# Altium project SmartHaloEE.PrjPcb (part 1 of 2)
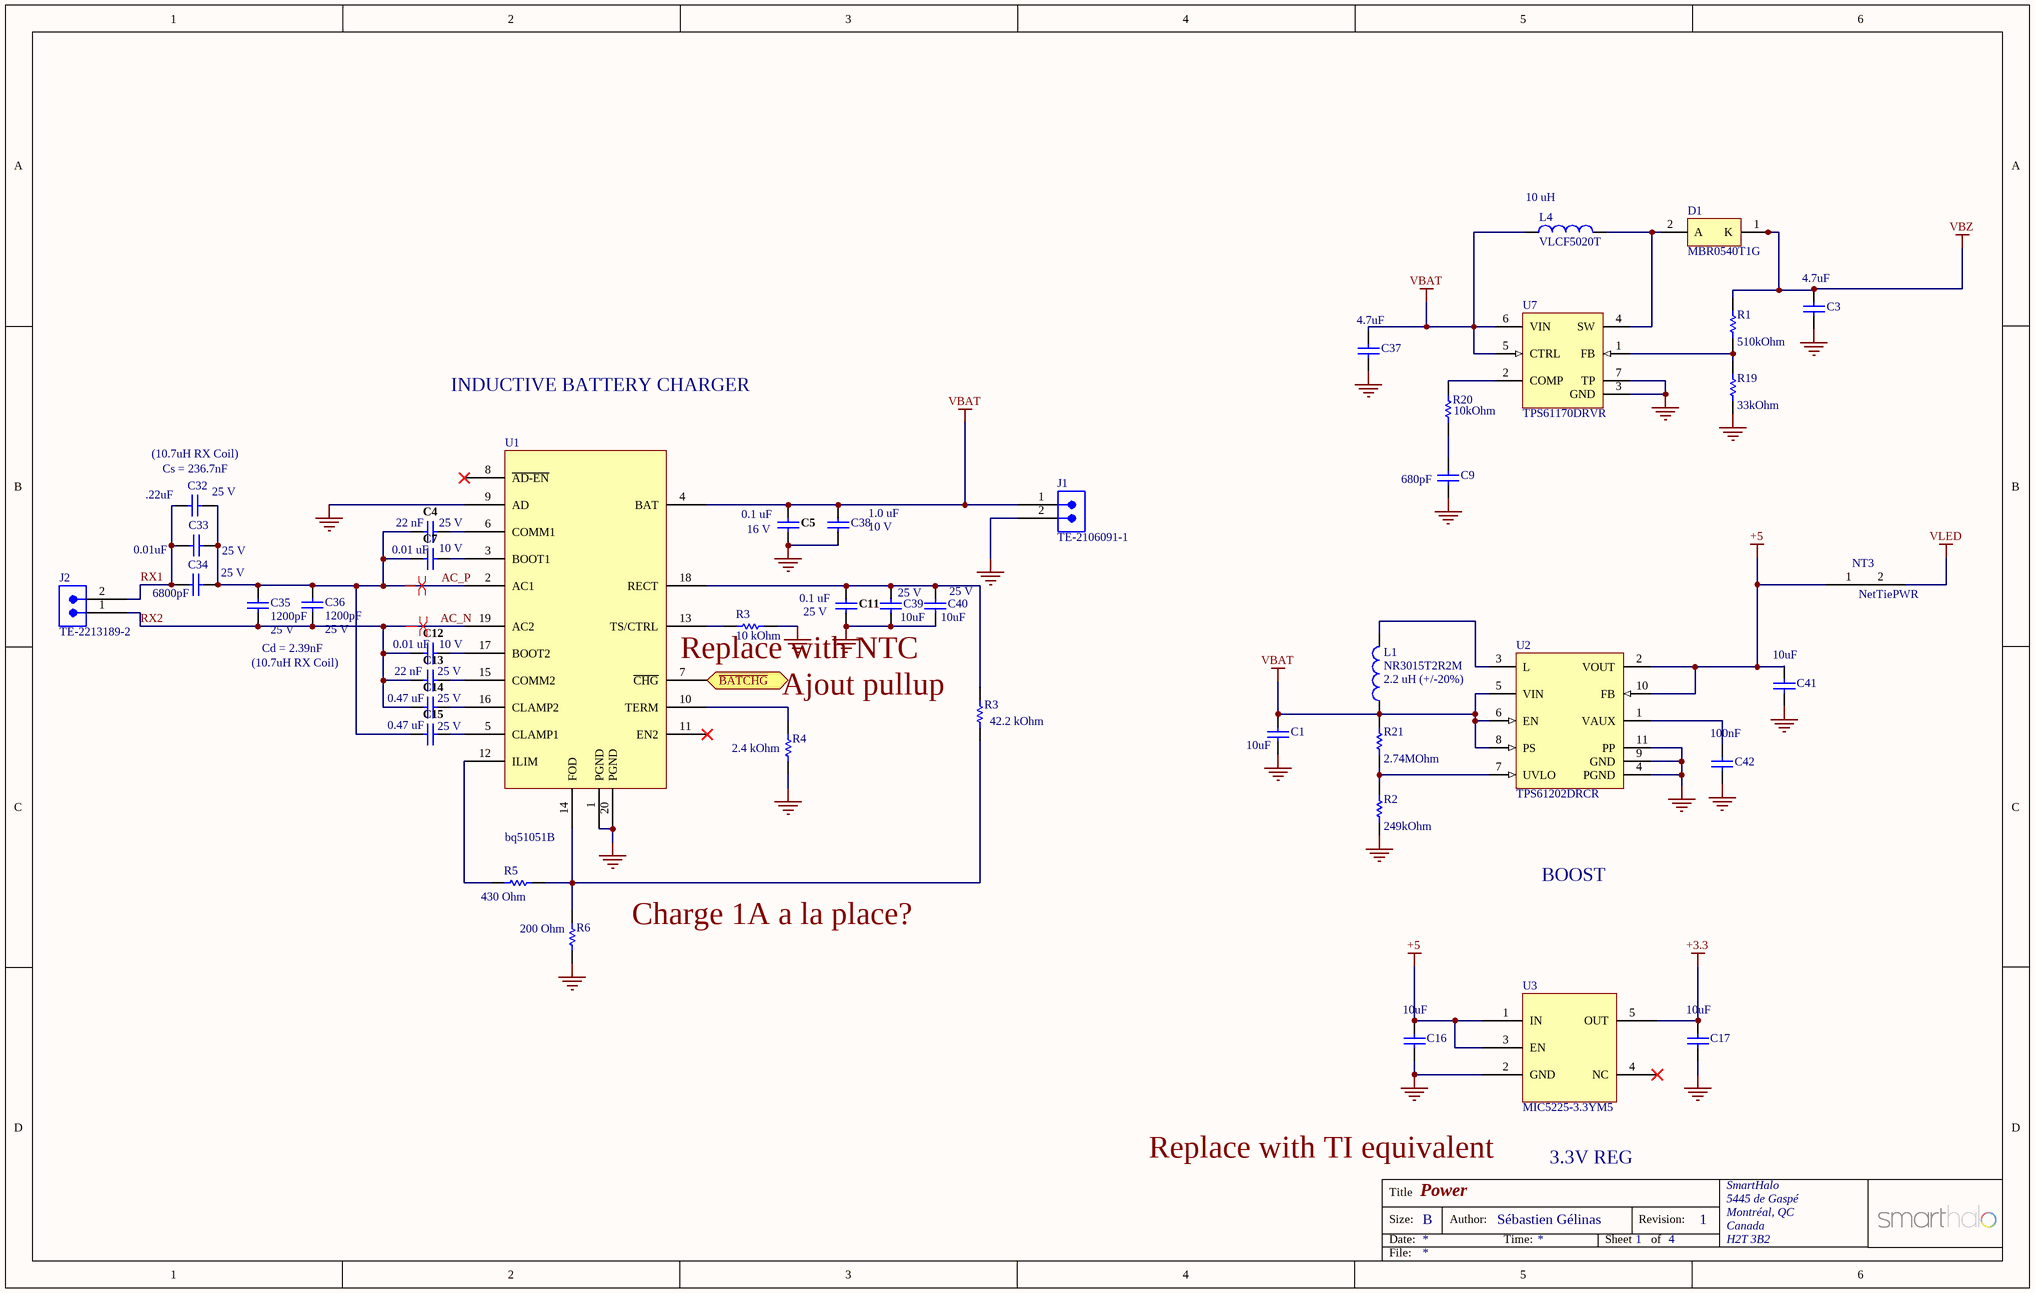
[diagram p0: PWR.SchDoc]
8 sheets, 165 parts. Net scope: flat (ports and power ports of the same name join across sheets).
Sheets:
  PWR.SchDoc
  SENSORS.SchDoc
  BLE.SchDoc
  ALARM.SchDoc
  CENTRALLEDS.SchDoc
  DRIVERS_CONNECTORS.SchDoc
  LEDS1.SchDoc
  LEDS2.SchDoc

## Sheet PWR.SchDoc: Power
size B; Author: Sébastien Gélinas; Organization: SmartHalo; Address1: 5445 de Gaspé; Address2: Montréal, QC; Address3: Canada; Address4: H2T 3B2; DocumentNumber: 1; Revision: 1; SheetNumber: 1; SheetTotal: 4

### Parts
(Parts that share a designator on the sheet are numbered #1, #2 ... from top to bottom, then left to right.)
C1  value 10uF  [CAPC0603(1608)100_N]  (hidden comment: CAP 10uF 10V 0603(1608))
C3  value 4.7uF  [CAPC0603(1608)100_N]  (hidden comment: CAP 10uF 10V 0603(1608))
C4  Rated Voltage: 25 V  Capacitance: 22 nF  [CAPC1005]  (hidden comment: CC0402KRX7R7BB104)
C5  Rated Voltage: 16 V  Capacitance: 0.1 uF  [CAPC1005]  (hidden comment: CC0402KRX7R7BB104)
C7  Rated Voltage: 10 V  Capacitance: 0.01 uF  [CAPC1005]  (hidden comment: CC0402KRX7R7BB104)
C9  value 680pF  [CAPC0402(1005)60_L]  (hidden comment: CAP 100nF 10V 0402(1005))
C11  Rated Voltage: 25 V  Capacitance: 0.1 uF  [CAPC1005]  (hidden comment: CC0402KRX7R7BB104)
C12  Rated Voltage: 10 V  Capacitance: 0.01 uF  [CAPC1005]  (hidden comment: CC0402KRX7R7BB104)
C13  Rated Voltage: 25 V  Capacitance: 22 nF  [CAPC1005]  (hidden comment: CC0402KRX7R7BB104)
C14  Rated Voltage: 25 V  Capacitance: 0.47 uF  [CAPC1005]  (hidden comment: CC0402KRX7R7BB104)
C15  Rated Voltage: 25 V  Capacitance: 0.47 uF  [CAPC1005]  (hidden comment: CC0402KRX7R7BB104)
C16  value 10uF  [CAPC0805(2012)145_N]  (hidden comment: CAP 10uF 10V 0805(2012))
C17  value 10uF  [CAPC0805(2012)145_N]  (hidden comment: CAP 10uF 10V 0805(2012))
C32  value .22uF  Rated Voltage: 25 V  [CAPC0402(1005)60_N]  (hidden comment: CAP 27pF 25V 0402(1005))
C33  value 0.01uF  Rated Voltage: 25 V  [CAPC0402(1005)60_N]  (hidden comment: CAP 27pF 25V 0402(1005))
C34  value 6800pF  Rated Voltage: 25 V  [CAPC0402(1005)60_N]  (hidden comment: CAP 27pF 25V 0402(1005))
C35  value 1200pF  Rated Voltage: 25 V  [CAPC0402(1005)60_N]  (hidden comment: CAP 27pF 25V 0402(1005))
C36  value 1200pF  Rated Voltage: 25 V  [CAPC0402(1005)60_N]  (hidden comment: CAP 27pF 25V 0402(1005))
C37  value 4.7uF  [CAPC0603(1608)100_N]  (hidden comment: CAP 10uF 10V 0603(1608))
C38  value 1.0 uF  Rated Voltage: 10 V  [CAPC0603(1608)100_N]  (hidden comment: CAP 10uF 10V 0603(1608))
C39  value 10uF  Rated Voltage: 25 V  [CAPC0603(1608)100_N]  (hidden comment: CAP 10uF 10V 0603(1608))
C40  value 10uF  Rated Voltage: 25 V  [CAPC0603(1608)100_N]  (hidden comment: CAP 10uF 10V 0603(1608))
C41  value 10uF  [CAPC0603(1608)100_N]  (hidden comment: CAP 10uF 10V 0603(1608))
C42  value 100nF  [CAPC0402(1005)60_L]  (hidden comment: CAP 100nF 10V 0402(1005))
D1  MBR0540T1G  [ONSC-SOD-123-2-425-04_V]
J1  TE-2106091-1  [TE-2106091-1]
J2  TE-2213189-2  [TE-2213189-2]
L1  NR3015T2R2M  Inductance: 2.2 uH (+/-20%)  [TAYO-IND0315_V]
L4  VLCF5020T  value 10 uH  [VLCF5020T-100M1R1-1]
NT3  NetTiePWR  [NetTiePWR]  (net tie, no BOM)
R1  value 510kOhm  [RESC0402(1005)_L]  (hidden comment: 2M74 1% 0402(1005))
R2  value 249kOhm  [RESC0402(1005)_N]  (hidden comment: 249K 1% 0402(1005))
R3#1  value 10 kOhm  [RESC0402(1005)_M]  (hidden comment: 10k 5% 0402(1005))
R3#2  value 42.2 kOhm  [RESC0402(1005)_M]  (hidden comment: 1R6 5% 0402(1005))
R4  value 2.4 kOhm  [RESC0402(1005)_M]  (hidden comment: 1R6 5% 0402(1005))
R5  value 430 Ohm  [RESC0402(1005)_M]  (hidden comment: 1R6 5% 0402(1005))
R6  value 200 Ohm  [RESC0402(1005)_M]  (hidden comment: 1R6 5% 0402(1005))
R19  value 33kOhm  [RESC0402(1005)_L]  (hidden comment: 2M74 1% 0402(1005))
R20  value 10kOhm  [RESC0402(1005)_L]  (hidden comment: 2M74 1% 0402(1005))
R21  value 2.74MOhm  [RESC0402(1005)_L]  (hidden comment: 2M74 1% 0402(1005))
U1  bq51051B  [RHL20-3050X2050TP]
U2  TPS61202DRCR  [DRC10-2400X1650TP]
U3  MIC5225-3.3YM5  [SOT23-5_N]
U7  TPS61170DRVR  [DRV6-1600X1000TP]

### Ports
~{BATCHG} (out)

### Nets
+3.3: C17.2 U3.5(OUT)
+5: C16.2 C41.2 NT3.1(NET1) U2.2(VOUT) U2.10(FB) U3.1(IN) U3.3(EN)
GND: C1.1 C3.1 C5.2 C9.1 C11.2 C16.1 C17.1 C37.1 C38.1 C39.1 C40.1 C41.1 C42.1 J1.2 R2.2 R3#1.1 R4.1 R6.1 R19.1 U1.1(PGND) U1.9(AD) U1.20(PGND) U1.21(TP) U2.4(PGND) U2.9(GND) U2.11(PP) U3.2(GND) U7.3(GND) U7.7(TP)
VBAT: C1.2 C5.1 C37.2 C38.2 J1.1 L1.1 L4.1 R21.2 U1.4(BAT) U2.5(VIN) U2.6(EN) U2.8(PS) U7.5(CTRL) U7.6(VIN)
VBZ: C3.2 D1.1(K) R1.2
VLED: NT3.2(NET2)
AC_N: C12.1 C13.1 C14.1 C35.1 C36.1 J2.1 U1.19(AC2)  [also labelled RX2]
AC_P: C4.1 C7.1 C15.1 C32.2 C33.2 C34.2 C35.2 C36.2 U1.2(AC1)
P0.30: U1.7(~{CHG}) ; port ~{BATCHG}
RX1: C32.1 C33.1 C34.1 J2.2
NetC4_2: C4.2 U1.6(COMM1)
NetC7_2: C7.2 U1.3(BOOT1)
NetC9_2: C9.2 R20.1
NetC11_1: C11.1 C39.2 C40.2 R3#2.2 U1.18(RECT)
NetC12_2: C12.2 U1.17(BOOT2)
NetC13_2: C13.2 U1.15(COMM2)
NetC14_2: C14.2 U1.16(CLAMP2)
NetC15_2: C15.2 U1.5(CLAMP1)
NetC42_2: C42.2 U2.1(VAUX)
NetD1_2: D1.2(A) L4.2 U7.4(SW)
NetL1_2: L1.2 U2.3(L)
NetR1_1: R1.1 R19.2 U7.1(FB)
NetR2_1: R2.1 R21.1 U2.7(UVLO)
NetR3#1_2: R3#1.2 U1.13(TS/CTRL)
NetR3#2_1: R3#2.1 R5.2 R6.2 U1.14(FOD)
NetR4_2: R4.2 U1.10(TERM)
NetR5_1: R5.1 U1.12(ILIM)
NetR20_2: R20.2 U7.2(COMP)

Not connected (* = marked no-connect by the designer): U1 8(~{AD-EN})* 11(EN2)*; U3 4(NC)*

### Layout directives
differential pair: AC_N, AC_P

### Notes on the sheet
- INDUCTIVE BATTERY CHARGER
- (near C32) (10.7uH RX Coil)
- (near C32) Cs = 236.7nF
- (10.7uH RX Coil)
- Cd = 2.39nF
- (near R3#1) Replace with NTC
- (near R3#2) Ajout pullup
- BOOST
- Charge 1A a la place?
- Replace with TI equivalent
- 3.3V REG
- Title
- Size:
- Date:
- B
- Author:
- Time:
- Sheet
- Revision:
- of
- File:

### Library data of the parts
C1 C3 C37-C41 = CMP-1035-02799-1: CAP 10uF 10V Â±10% 0603 (1608 Metric) Thickness 1mm SMD; Case-Metric: 1608; Case-EIA: 0603; Max Thickness: 1 mm; Tolerance: Â±10%; Technology: SMT
  C1 C3 C37 C41: Rated Voltage: 10 V
C4 C5 C7 C11-C15 = CMP-0001-00074-1: Capacitor, Yageo, Ceramic, 0.1uF 10% 16V 0402 (1005) X7R; Polarity: Non-Polarized; ClassName: Board Template Device; Status: Production; Tolerance: 10 %; Mounting Technology: Surface Mount; Technology: Ceramic; Category: Capacitor; Dielectric: X7R; Publisher: Altium
C9 C42 = CMP-1034-02064-1: CAP 100nF 10V Â±5% 0402 (1005 Metric) Thickness 0.6mm SMD; Case-EIA: 0402; Case-Metric: 1005; Max Thickness: 0.6 mm; Tolerance: Â±5%; Rated Voltage: 10 V; Technology: SMT
C16 C17 = CMP-1036-04922-1: CAP 10uF 10V Â±10% 0805 (2012 Metric) Thickness 1.45mm SMD; Case-EIA: 0805; Case-Metric: 2012; Technology: SMT; Tolerance: Â±10%; Rated Voltage: 10 V; Max Thickness: 1.45 mm
C32-C36 = CMP-1034-00958-1: CAP 27pF 25V Â±10% 0402 (1005 Metric) Thickness 0.6mm SMD; Case-EIA: 0402; Case-Metric: 1005; Tolerance: Â±10%; Technology: SMT; Max Thickness: 0.6 mm
D1 = CMP-1055-00401-1: Schottky Power Rectifier, 2-Pin SOD-123, Pb-Free, Tape and Reel; Manufacturer: On Semiconductor; IFSM Max (A): 5.5; Configuration: Single; ComponentLink1URL: http://www.onsemi.com/; ComponentLink3Description: Package Specification; RoHS: TRUE; PackageVersion: Rev. G, 10/2009; DatasheetVersion: Rev. 7; ComponentLink3URL: http://www.onsemi.com/pub_link/Collateral/425-04.PDF; Packing: Tape and Reel; ComponentLink1Description: Manufacturer URL; PackageDescription: 2-Pin SOD, Body 1.6 x 2.69 mm; PartNumber: MBR0540T1G; ComponentLink2Description: Datasheet; ComponentLink2URL: http://www.onsemi.cn/pub_link/Collateral/MBR0540T1-D.PDF; PackageReference: SOD-123-2-425-04; Mounting Technology: Surface Mount
J1 = TE-2106091-1: 2 pos Inverted Thru Board SMT Header; Manufacturer: TE; Manufacturer Part Number: 2106091
J2 = TE-2213189-2: Assembly, IPI Connector 26-24GA w/o cap; Manufacturer: TE; Manufacturer Part Number: 2213189-2
L1 = CMP-0569-00001-1: SMD Power Inductor, 2.2 uH, +/-20%, 3 x 3 x 1.5 mm, -25 to 120 degC, Pb-Free, Tape and Reel; Manufacturer: Taiyo Yuden; Avg. of DC. Resistance: 0.06 Ohm; DC Resistance (max): 0.072 Ohm; Soldering Method: Reflow; Rated Current-Temperature Rise Current: 1500 mA; Self-Resonant Frequency (min): 64 MHz; Inductance Measuring Frequency: 100 kHz; Rated Current-Saturation Current: 1480 mA; DatasheetVersion: 1/11/2013; ComponentLink1Description: Manufacturer URL; Packing: Tape and Reel; ComponentLink1URL: www.yuden.co.jp; Case Size: 3015; PackageDescription: 2-Pin SMT Inductor, Body 3 x 3 mm; Mounting Technology: Surface Mount; Halogen Free: TRUE; PartNumber: NR3015T2R2M; PackageReference: IND3015; ComponentLink2URL: http://www.yuden.co.jp/ut/product/category/inductor/NR3015T2R2M.pdf; RoHS Compliance: TRUE; Temperature Range: -25 to 120 degC; ComponentLink2Description: Datasheet
L4 = VLCF5020T-100M1R1-1: FIXED IND 10UH 1.13A 237 MOHM
R1 R19-R21 = CMP-1011-00897-1: 2M74 0.063W 1% 0402 (1005 Metric)  SMD; Case-EIA: 0402; Case-Metric: 1005; Tolerance: 1 %; Power: 0.063 W; Technology: SMT
R2 = CMP-1011-00779-1: 249K 0.063W 1% 0402 (1005 Metric)  SMD; Case-EIA: 0402; Case-Metric: 1005; Power: 0.063 W; Tolerance: 1 %; Technology: SMT
R3#1 = CMP-1011-00007-1: 10K 0.063W 5% 0402 (1005 Metric)  SMD; Case-EIA: 0402; Case-Metric: 1005; Tolerance: 5 %; Technology: SMT; Power: 0.063 W
R3#2 R4-R6 = CMP-1011-00007-1: 1R6 0.063W 5% 0402 (1005 Metric)  SMD; Case-EIA: 0402; Case-Metric: 1005; Tolerance: 5 %; Technology: SMT; Power: 0.063 W
U1 = bq51051B: IC WIRELESS PWR RCVR 20QFN
U2 = CMP-0343-00055-1: Boost Voltage Converter with 0.3 to 5.5 V Input and 5 V Output, -40 to 85 degC, 10-Pin SON (DRC), Green (RoHS & no Sb/Br); Manufacturer: Texas Instruments; Vout(Min)(V): 5; Vin(Min)(V): 0.3; Synchronous Rectification: TRUE; SubFamily: Step-Up Regulator; Vin(Max)(V): 5.5; Regulated Outputs(#): 1; Switching Frequency(Max)(kHz): 1250; DatasheetVersion: SLVS577B; Eco-Plan: Green (RoHS & no Sb/Br); PackageVersion: revL, Sep-2011; ComponentLink1Description: Datasheet; ComponentLink1URL: http://www.ti.com/general/docs/lit/getliterature.tsp?genericPartNumber=TPS61202&fileType=pdf; PartNumber: TPS61202DRCR; Vout(Max)(V): 5; Topology: Boost; ComponentLink2Description: Package Specification; Mounting Technology: Surface Mount; PackageDescription: 10-Pin Plastic Small Outline No-Lead, 3 x 3 x 1 mm Body, 0.5 mm Pitch, Exposed Pad; PackageReference: DRC10-2400X1650TP; Preset Vout(V): 5; ComponentLink2URL: http://www.ti.com/litv/pdf/mpds117k
U3 = MIC5225-3.3YM5: IC REG LDO 3.3V 0.15A SOT23-5
U7 = CMP-0347-00039-1: Boost Voltage Converter with 3 to 18 V Input and 3 to 38 V Output, -40 to 85 degC, 6-Pin SON (DRC), Green (RoHS & no Sb/Br); Manufacturer: Texas Instruments; Regulated Outputs(#): 1; Vout(Min)(V): 3; SubFamily: Step-Up Regulator; Dynamic Voltage Scaling: TRUE; Vin(Max)(V): 18; Switching Frequency(Max)(kHz): 1200; Vout(Max)(V): 38; Eco-Plan: Green (RoHS & no Sb/Br); Topology: Boost; ComponentLink1Description: Datasheet; DatasheetVersion: SLVS789C; ComponentLink2URL: http://www.ti.com/litv/pdf/mpds216d; PackageReference: DRV6-1600X1000TP; PartNumber: TPS61170DRVR; ComponentLink1URL: http://www.ti.com/general/docs/lit/getliterature.tsp?genericPartNumber=TPS61170&fileType=pdf; PackageVersion: revE, Oct-2010; Mounting Technology: Surface Mount; Vin(Min)(V): 3; ComponentLink2Description: Package Specification; PackageDescription: 6-Pin Plastic Small Outline No-Lead, 2 x 2 x 0.8 mm Body, 0.65 mm Pitch, Exposed Pad

## Sheet SENSORS.SchDoc: Sensors
size B; Author: Sébastien Gélinas; Organization: SmartHalo; Address1: 5445 de Gaspé; Address2: Montréal, QC; Address3: Canada; Address4: H2T 3B2; DocumentNumber: 2; Revision: 1; SheetNumber: 2; SheetTotal: 4
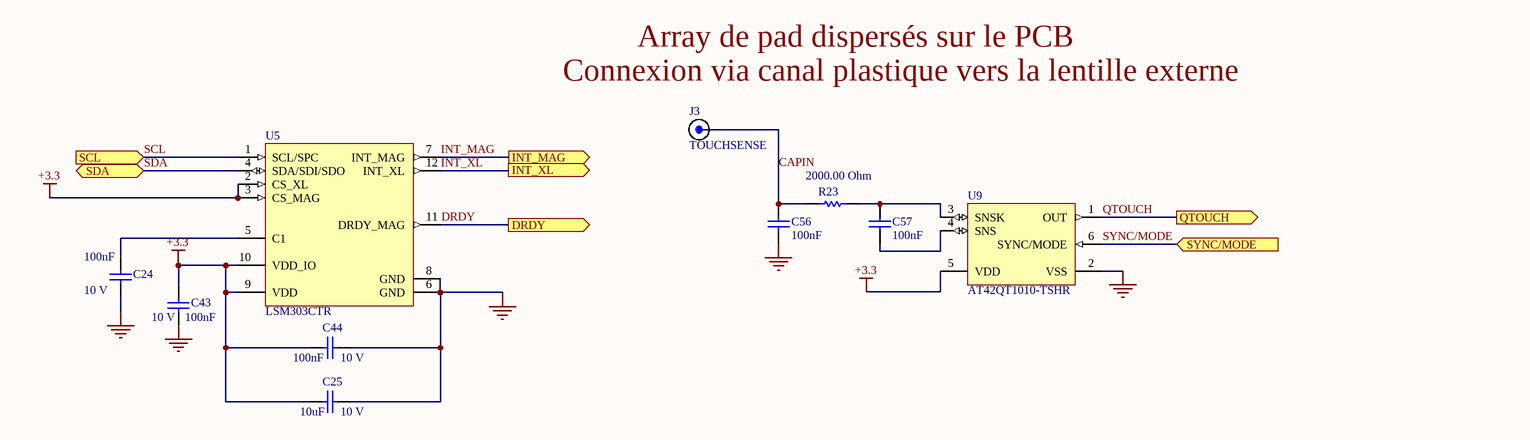
[diagram p1: SENSORS.SchDoc]

### Parts
C24  value 100nF  Rated Voltage: 10 V  [CAPC0402(1005)60_L]  (hidden comment: CAP 100nF 10V 0402(1005))
C25  value 10uF  Rated Voltage: 10 V  [CAPC0603(1608)100_N]  (hidden comment: CAP 10uF 10V 0603(1608))
C43  value 100nF  Rated Voltage: 10 V  [CAPC0402(1005)60_L]  (hidden comment: CAP 100nF 10V 0402(1005))
C44  value 100nF  Rated Voltage: 10 V  [CAPC0402(1005)60_L]  (hidden comment: CAP 100nF 10V 0402(1005))
C56  value 100nF  [CAPC0402(1005)60_L]  (hidden comment: CAP 100nF 10V 0402(1005))
C57  value 100nF  [CAPC0402(1005)60_L]  (hidden comment: CAP 100nF 10V 0402(1005))
J3  TOUCHSENSE  [TOUCHSENSE]  (no BOM)
R23  value 2000.00 Ohm  [RESC0603(1608)_N]  (hidden comment: 2K 5% 0603(1608))
U5  LSM303CTR  [LGA12-2X2X1_N]
U9  AT42QT1010-TSHR  [6ST1_M]

### Ports
DRDY (out), INT_MAG (out), INT_XL (out), QTOUCH (out), SCL (in), SDA (bidir), SYNC/MODE (in)

### Nets
+3.3: C25.2 C43.1 C44.2 U5.2(CS_XL) U5.3(CS_MAG) U5.9(VDD) U5.10(VDD_IO) U9.5(VDD)
GND: C24.2 C25.1 C43.2 C44.1 C56.1 U5.6(GND) U5.8(GND) U9.2(VSS)
CAPIN: C56.2 J3.1 R23.2
DRDY: U5.11(DRDY_MAG) ; port DRDY
INT_MAG: U5.7(INT_MAG) ; port INT_MAG
INT_XL: U5.12(INT_XL) ; port INT_XL
QTOUCH: U9.1(OUT) ; port QTOUCH  [project net P0.08]
SCL: U5.1(SCL/SPC) ; port SCL
SDA: U5.4(SDA/SDI/SDO) ; port SDA  [project net P0.11]
SYNC/MODE: U9.6(SYNC/MODE) ; port SYNC/MODE  [project net P0.09]
NetC24_1: C24.1 U5.5(C1)
NetC57_1: C57.1 U9.4(SNS)
NetC57_2: C57.2 R23.1 U9.3(SNSK)

### Notes on the sheet
- (near J3) Connexion via canal plastique vers la lentille externe
- Array de pad dispersés sur le PCB
- Title
- Size:
- Date:
- B
- Author:
- Time:
- Sheet
- Revision:
- of
- File:

### Library data of the parts
C24 C43 C44 C56 C57 = CMP-1034-02064-1: as C9 on sheet PWR; Max Thickness: 0.6 mm; Tolerance: Â±5%; Technology: SMT
  C56 C57: Rated Voltage: 10 V
C25 = CMP-1035-02799-1: as C1 on sheet PWR; Max Thickness: 1 mm; Tolerance: Â±10%; Technology: SMT
J3 = TOUCHSENSE: Touch Sensor pad connection
R23 = CMP-1012-00081-1: 2K 0.1W 5% 0603 (1608 Metric)  SMD; Case-Metric: 1608; Case-EIA: 0603; Tolerance: 5 %; Technology: SMT; Power: 0.1 W
U5 = SEN-MOT-LSM303CTR-12: 3D ACCELEROMETER/MAGNETOMETER
U9 = CMP-0073-00038-1: One-channel Touch Sensor IC with Reset Timer, -40Â° to +85Â° C, 6-pin SOT23; DatasheetVersion: revH, May-2010; Code_IPC: SOT26A-6; PackageDescription: 6-Lead, 2.90 x 1.60 mm Plastic Small Outline Package (SOT23); PackageVersion: revA, Jun-2008; PackageReference: 6ST1; ComponentLink2Description: Datasheet; ComponentLink2URL: http://www.atmel.com/Images/doc9541.pdf; ComponentLink1URL: http://www.atmel.com/; ComponentLink1Description: Manufacturer URL; Code_JEDEC: MO-178-AB

## Sheet BLE.SchDoc: RF/Bluetooth
size B; Author: Sébastien Gélinas; Organization: SmartHalo; Address1: 5445 de Gaspé; Address2: Montréal, QC; Address3: Canada; Address4: H2T 3B2; DocumentNumber: 4; Revision: 1; SheetNumber: 4; SheetTotal: 4
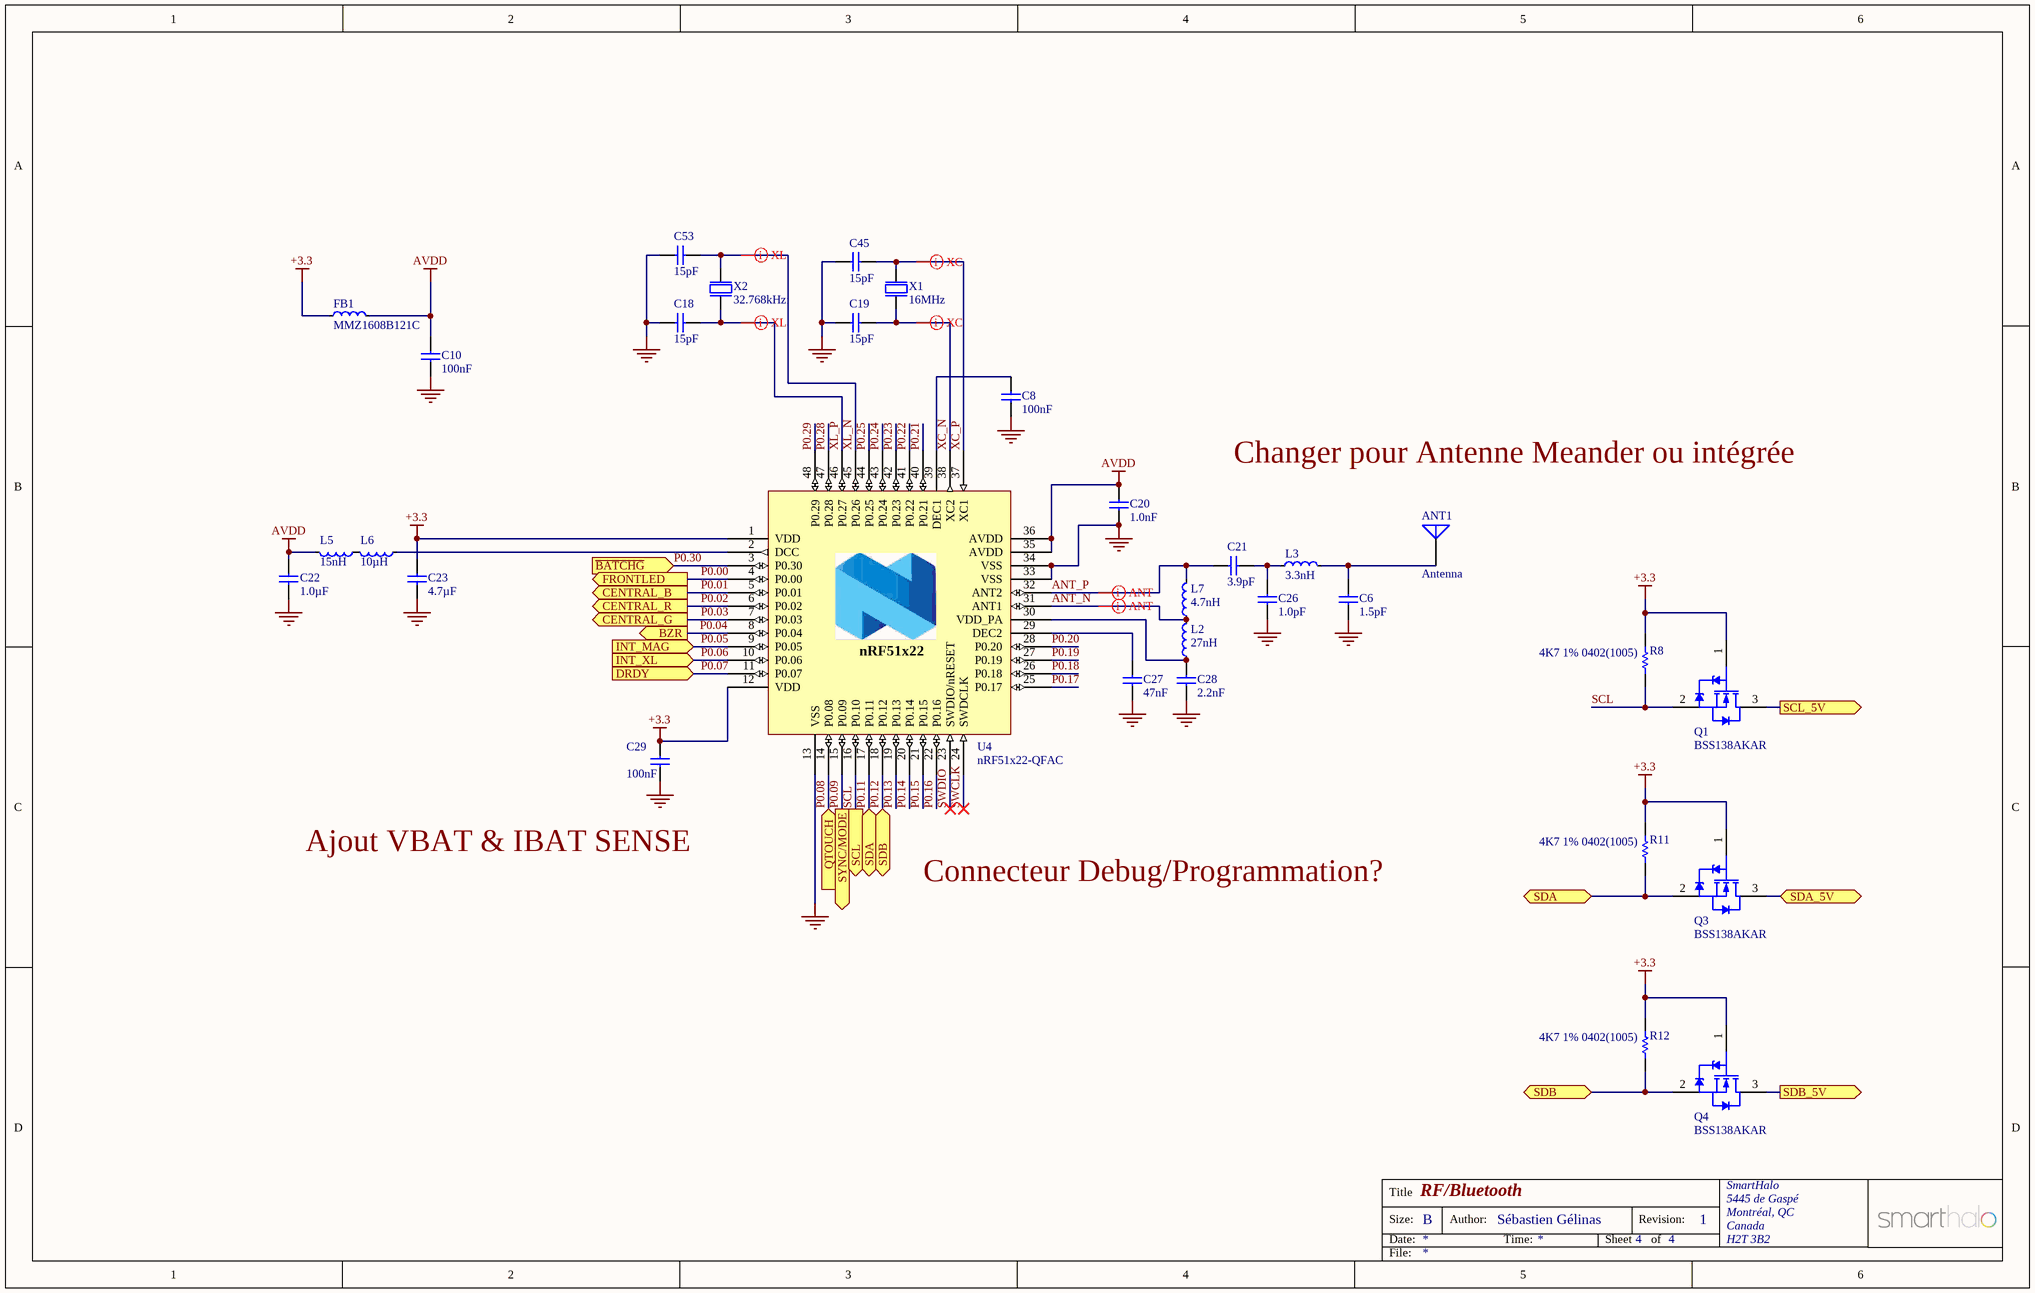
[diagram p2: BLE.SchDoc]

### Parts
ANT1  Antenna  [ANTENNA_PCB_2.4GHZ]  (no BOM)
C6  1.5pF  [CAPC1005X04L]
C8  100nF  [CAPC1005X04L]
C10  100nF  [CAPC0805(2012)100_N]
C18  15pF  [CAPC0805(2012)100_N]
C19  15pF  [CAPC0805(2012)100_N]
C20  1.0nF  [CAPC1005X04L]
C21  3.9pF  [CAPC1005X04L]
C22  1.0µF  [CAPC1608X06L]
C23  4.7µF  [CAPC1608X06L]
C26  1.0pF  [CAPC1005X04L]
C27  47nF  [CAPC1005X04L]
C28  2.2nF  [CAPC1005X04L]
C29  100nF  [CAPC1005X04L]
C45  15pF  [CAPC0805(2012)100_N]
C53  15pF  [CAPC0805(2012)100_N]
FB1  MMZ1608B121C  [CAPC0805(2012)100_N]
L2  27nH  [INDC1005X04L]
L3  3.3nH  [INDC1005X04L]
L5  15nH  [INDC1005X04L]
L6  10µH  [INDC1608X06L]
L7  4.7nH  [INDC1005X04L]
Q1  BSS138AKAR  [NXP-SOT23_N]
Q3  BSS138AKAR  [NXP-SOT23_N]
Q4  BSS138AKAR  [NXP-SOT23_N]
R8  4K7 1% 0402(1005)  [RESC0402(1005)_N]
R11  4K7 1% 0402(1005)  [RESC0402(1005)_N]
R12  4K7 1% 0402(1005)  [RESC0402(1005)_N]
U4  nRF51x22-QFAC  [QFN40P600X600X90-48N]
X1  16MHz  [CRYSTAL_16MHz_SMT4]
X2  32.768kHz  [CRYSTAL_32.768kHz_SMT2]

### Ports
BZR (out), CENTRAL_B (out), CENTRAL_G (out), CENTRAL_R (out), DRDY (in), FRONTLED (out), INT_MAG (in), INT_XL (in), QTOUCH (in), SCL (out), SCL_5V (out), SDA (bidir), SDA_5V (bidir), SDB (bidir), SDB_5V (out), SYNC/MODE (out), ~{BATCHG} (in)

### Nets
+3.3: C23.1 C29.1 FB1.1 Q1.1(G) Q3.1(G) Q4.1(G) R8.2 R11.2 R12.2 U4.1(VDD) U4.12(VDD)
AVDD: C10.2 C20.1 C22.2 FB1.2 L5.2 U4.35(AVDD) U4.36(AVDD)
GND: C6.2 C8.2 C10.1 C18.1 C19.2 C20.2 C22.1 C23.2 C26.2 C27.2 C28.2 C29.2 C45.2 C53.1 U4.13(VSS) U4.33(VSS) U4.34(VSS) U4.49 X1.2(GND) X1.4(GND)
ANT_N: L2.2 L7.1 U4.31(ANT1)
ANT_P: C21.1 L7.2 U4.32(ANT2)
P0.00: U4.4(P0.00) ; port FRONTLED  [project net FRONTLED]
P0.01: U4.5(P0.01) ; port CENTRAL_B  [project net CENTRAL_B]
P0.02: U4.6(P0.02) ; port CENTRAL_R  [project net CENTRAL_R]
P0.03: U4.7(P0.03) ; port CENTRAL_G  [project net CENTRAL_G]
P0.04: U4.8(P0.04) ; port BZR
P0.05: U4.9(P0.05) ; port INT_MAG  [project net INT_MAG]
P0.06: U4.10(P0.06) ; port INT_XL  [project net INT_XL]
P0.07: U4.11(P0.07) ; port DRDY  [project net DRDY]
P0.08: U4.14(P0.08) ; port QTOUCH
P0.09: U4.15(P0.09) ; port SYNC/MODE
P0.11: Q3.2(S) R11.1 U4.17(P0.11) ; port SDA
P0.12: Q4.2(S) R12.1 U4.18(P0.12) ; port SDB
P0.13: U4.19(P0.13)
P0.14: U4.20(P0.14)
P0.15: U4.21(P0.15)
P0.16: U4.22(P0.16)
P0.17: U4.25(P0.17)
P0.18: U4.26(P0.18)
P0.19: U4.27(P0.19)
P0.20: U4.28(P0.20)
P0.21: U4.40(P0.21)
P0.22: U4.41(P0.22)
P0.23: U4.42(P0.23)
P0.24: U4.43(P0.24)
P0.25: U4.44(P0.25)
P0.28: U4.47(P0.28)
P0.29: U4.48(P0.29)
P0.30: U4.3(P0.30) ; port ~{BATCHG}
SCL: Q1.2(S) R8.1 U4.16(P0.10) ; port SCL
SCL_5V: Q1.3(D) ; port SCL_5V
SDA_5V: Q3.3(D) ; port SDA_5V
SDB_5V: Q4.3(D) ; port SDB_5V
SWCLK: U4.24(SWDCLK)
SWDIO: U4.23(SWDIO/nRESET)
XC_N: C19.1 U4.38(XC2) X1.1(inp)
XC_P: C45.1 U4.37(XC1) X1.3(out)
XL_N: C53.2 U4.45(P0.26) X2.1(inp)
XL_P: C18.2 U4.46(P0.27) X2.2(out)
NetANT1_1: ANT1.1 C6.1 L3.2
NetC8_1: C8.1 U4.39(DEC1)
NetC21_2: C21.2 C26.1 L3.1
NetC27_1: C27.1 U4.29(DEC2)
NetC28_1: C28.1 L2.1 U4.30(VDD_PA)
NetL5_1: L5.1 L6.2
NetL6_1: L6.1 U4.2(DCC)

### Layout directives
differential pair: ANT_N, ANT_P, XC_N, XC_P, XL_N, XL_P

### Notes on the sheet
- Changer pour Antenne Meander ou intégrée
- Ajout VBAT & IBAT SENSE
- Connecteur Debug/Programmation?
- Title
- Size:
- Date:
- B
- Author:
- Time:
- Sheet
- Revision:
- of
- File:
- (in symbol nRF51x22_QFAx) nRF51x22

### Library data of the parts
ANT1 = ANTENNA_PCB_2.4GHz: Antenna PCB, 2.4GHz, 26.11 mm x 1.27 mm, FR4 60 mils, Er = 4.2
C6 = C0402-1.5p: Capacitor, NP0, ±0.1pF; Note: 50V; Artikkelnr Noca: 20029139; Artikkelnr Simpro: N.A.; Part Number: C0402-1.5p; Manufacturer: *; Manufacturer Part Number: *; Datasheet: *; LatestRevisionDate: 2009-11-23; Pin Count: 2; Publisher: Nordic Semiconductor; Published: 2009-05-08; Value: 1.5pF; Supplier: *; Supplier part number: *; 2nd source Supplier: *; 2nd source part number: *; Footprint Doc: 0402
C8 C29 = C0402-100n: Capacitor, X7R, ±10%; Note: 16V; Artikkelnr Noca: 20039200; Artikkelnr Simpro: N.A.; Part Number: C0402-100n; Manufacturer: *; Manufacturer Part Number: *; Datasheet: *; LatestRevisionDate: 2009-11-23; Pin Count: 2; Publisher: Nordic Semiconductor; Published: 2009-05-08; Value: 100nF; Supplier: *; Supplier part number: *; 2nd source Supplier: *; 2nd source part number: *; Footprint Doc: 0402
C10 = C0402-100n: CAP 100nF *V ±10% X7R 0805 (2012 Metric); Case-EIA: 0805; Case-Metric: 2012; Capacitance: 100nF; Rated Voltage: *; Tolerance: ±10%; Dielectric: X7R
C18 C19 C45 C53 = C0402-15p: CAP 15pF *V ±5% NP0 0805 (2012 Metric); Case-EIA: 0805; Case-Metric: 2012; Capacitance: 15pF; Dielectric: NP0; Rated Voltage: *; Tolerance: ±5%
C20 = C0402-1n0: Capacitor, X7R, ±10%; Note: 50V; Artikkelnr Noca: 20039223; Artikkelnr Simpro: N.A.; Part Number: C0402-1n0; Manufacturer: *; Manufacturer Part Number: *; Datasheet: *; LatestRevisionDate: 2009-11-23; Pin Count: 2; Publisher: Nordic Semiconductor; Published: 2009-05-08; Value: 1.0nF; Supplier: *; Supplier part number: *; 2nd source Supplier: *; 2nd source part number: *; Footprint Doc: 0402
C21 = C0402-3.9p: Capacitor, NP0, ±0.1pF; Note: 50V; Artikkelnr Noca: N.A.; Part Number: C0402-3.9p; Manufacturer: *; Manufacturer Part Number: *; Datasheet: *; LatestRevisionDate: 2014-09-17; Pin Count: 2; Publisher: Nordic Semiconductor; Published: 2009-05-08; Value: 3.9pF; Supplier: *; Supplier part number: *; 2nd source Supplier: *; 2nd source part number: *; Footprint Doc: 0402; Artikkelnr Simpro: N.A.
C22 = C0603-1µ0: Capacitor, X7R, ±10%; Note: 16V; Artikkelnr Noca: 20039335; Artikkelnr Simpro: N.A.; Part Number: C0603-1µ0; Manufacturer: *; Manufacturer Part Number: *; Datasheet: *; LatestRevisionDate: 2013-06-05; Pin Count: 2; Publisher: Nordic Semiconductor; Published: 2009-05-08; Value: 1.0µF; Supplier: *; Supplier part number: *; 2nd source Supplier: *; 2nd source part number: *; Footprint Doc: 0603
C23 = C0603-4µ7: Capacitor, X5R, ±10%; Note: 6.3V; Artikkelnr Noca: 20069060; Artikkelnr Simpro: N.A.; Part Number: C0603-4µ7; Manufacturer: *; Manufacturer Part Number: *; Datasheet: *; LatestRevisionDate: 2009-11-23; Pin Count: 2; Publisher: Nordic Semiconductor; Published: 2009-05-08; Value: 4.7µF; Supplier: *; Supplier part number: *; 2nd source Supplier: *; 2nd source part number: *; Footprint Doc: 0603
C26 = C0402-1.0p: Capacitor, NP0, ±0.1pF; Note: 50V; Artikkelnr Noca: 20029140; Artikkelnr Simpro: N.A.; Part Number: C0402-1.0p; Manufacturer: *; Manufacturer Part Number: *; Datasheet: *; LatestRevisionDate: 2009-11-23; Pin Count: 2; Publisher: Nordic Semiconductor; Published: 2009-05-08; Value: 1.0pF; Supplier: *; Supplier part number: *; 2nd source Supplier: *; 2nd source part number: *; Footprint Doc: 0402
C27 = C0402-47n: Capacitor, X7R, ±10%; Note: Chip Cap 10%; Artikkelnr Noca: 20039389; Artikkelnr Simpro: N.A.; Part Number: C0402-47n; Manufacturer: *; Manufacturer Part Number: *; Datasheet: *; LatestRevisionDate: 2009-05-08; Pin Count: 2; Publisher: Nordic Semiconductor; Published: 2009-05-08; Value: 47nF; Supplier: *; Supplier part number: *; 2nd source Supplier: *; 2nd source part number: *; Footprint Doc: 0402
C28 = C0402-2n2: Capacitor, X7R, ±10%; Note: 50V; Artikkelnr Noca: 20039221; Artikkelnr Simpro: N.A.; Part Number: C0402-2n2; Manufacturer: *; Manufacturer Part Number: *; Datasheet: *; LatestRevisionDate: 2009-11-23; Pin Count: 2; Publisher: Nordic Semiconductor; Published: 2009-05-08; Value: 2.2nF; Supplier: *; Supplier part number: *; 2nd source Supplier: *; 2nd source part number: *; Footprint Doc: 0402
FB1 = L0402-15n: Ferrite bead 0805; Case-EIA: 0805; Case-Metric: 2012
L2 = L0402-27n: High frequency chip inductor ±5%; Manufacturer: Murata; Manufacturer Part Number: LQP15MN27NG02D; Note: High frequency chip inductor ±2%; Artikkelnr Noca: N.A.; Part Number: L0402-27n; Datasheet: http://search.murata.co.jp/Ceramy/image/img/PDF/ENG/L0075S0084LQP15M.pdf; LatestRevisionDate: 2014-09-17; Pin Count: 2; Publisher: Nordic Semiconductor; Published: 2014-06-12; Value: 27nH; Supplier: Digi-Key; Supplier part number: 490-6751-1-ND; 2nd source Supplier: *; 2nd source part number: *; Footprint Doc: 0402; Artikkelnr Simpro: N.A.
L3 = L0402-3n3: High frequency chip inductor ±5%; Manufacturer: Murata; Manufacturer Part Number: LQP15MN3N3B02D; Artikkelnr Noca: 33029369; Artikkelnr Simpro: N.A.; Part Number: L0402-3n3; Datasheet: http://search.murata.co.jp/Ceramy/image/img/PDF/ENG/L0075S0084LQP15M.pdf; LatestRevisionDate: 2012-09-19; Pin Count: 2; Publisher: Nordic Semiconductor; Published: 2009-05-08; Value: 3.3nH; Note: High frequency chip inductor ±5%; Supplier: Digi-Key; Supplier part number: 490-1130-1-ND; 2nd source Supplier: *; 2nd source part number: *; Footprint Doc: 0402
L5 = L0402-15n: High frequency chip inductor ±10%; Manufacturer: Taiyo Yuden; Manufacturer Part Number: HK100515NJ-T; 2nd source part number: 658-1328; Artikkelnr Noca: 33029323; Artikkelnr Simpro: N.A.; Part Number: L0402-15n; LatestRevisionDate: 2012-09-19; Pin Count: 2; Publisher: Nordic Semiconductor; Published: 2010-07-12; Value: 15nH; Note: High frequency chip inductor ±10%; Supplier: Digi-Key; Datasheet: http://www.yuden.co.jp/productdata/catalog/en/mlci04_e.pdf; Supplier part number: 587-1521-1-ND; 2nd source Supplier: Farnell; Footprint Doc: 0402
L6 = L0603-10µ: Chip inductor, IDC,min = 50 mA, ±20%; Manufacturer: Taiyo Yuden; Manufacturer Part Number: LBMF1608T100K; 2nd source part number: 178-6105; Note: LBMF1608T100K 10µH 80mA 0603; Artikkelnr Noca: 33029314; Artikkelnr Simpro: N.A.; Part Number: L0603-10µ; Datasheet: http://www.yuden.co.jp/ut/product/pdf/elb2_e.pdf; LatestRevisionDate: 2012-09-19; Pin Count: 2; Publisher: Nordic Semiconductor; Published: 2010-02-24; Value: 10µH; Supplier: Digi-Key; Supplier part number: 587-1714-1-ND; 2nd source Supplier: Farnell; Footprint Doc: 0603
L7 = L0402-4n7: High frequency chip inductor ±5%; Manufacturer: Murata; Manufacturer Part Number: LQP15MN4N7B02D; Artikkelnr Noca: 33029164; Artikkelnr Simpro: N.A.; Part Number: L0402-4n7; Datasheet: http://search.murata.co.jp/Ceramy/image/img/PDF/ENG/L0075S0084LQP15M.pdf; LatestRevisionDate: 2012-09-19; Pin Count: 2; Publisher: Nordic Semiconductor; Published: 2009-05-08; Value: 4.7nH; Note: High frequency chip inductor ±5%; Supplier: Digi-Key; Supplier part number: 490-1132-1-ND; 2nd source Supplier: *; 2nd source part number: *; Footprint Doc: 0402
Q1 Q3 Q4 = CMP-1258-00119-1: Single N-Channel Trench MOSFET, 60 V, 0.2 A, -55 to 150 degC, 3-Pin SOT23, Tape and Reel; Manufacturer: NXP Semiconductors; ID [max] (A): 0.2; VGSth [typ] (V): 1.2; VDS [max] (V): 60; Coss [typ] (pF): 21; Ciss [typ] (pF): 31; Channel Type: N; Packing: Tape & Reel; ComponentLink1URL: http://www.nxp.com/; ComponentLink2URL: http://www.nxp.com/documents/data_sheet/BSS138AKA.pdf; ComponentLink3Description: Package Specification; PackageVersion: 06-03-16, 03/2006; ComponentLink2Description: Datasheet; ComponentLink3URL: http://www.nxp.com/documents/outline_drawing/sot023_po.pdf; PackageDescription: 3-Pin Small Outline Transistor Package, Body 2.9 x 1.3 mm, Pitch 0.95 mm; ComponentLink1Description: Manufacturer URL; PackageReference: SOT23; Code_JEDEC: TO-236AB; DatasheetVersion: Rev. 1; Mounting Technology: Surface Mount; PartNumber: BSS138AKAR
R8 R11 R12 = CMP-1011-00586-1: 4K7 0.063W 1% 0402 (1005 Metric)  SMD; Case-Metric: 1005; Value: 4700.00 Ohm; Case-EIA: 0402; Power: 0.063 W; Technology: SMT; Tolerance: 1 %
U4 = nRF51x22_QFAx: Multi-protocol Bluetooth Low Energy, ANT and 2.4GHz proprietary system-on-chip; Manufacturer: Nordic Semiconductor; Note: nRF51422 - QFN48 6x6 0.4mm pitch; Artikkelnr Noca: N.A.; Part Number: nRF51x22-QFAC; Manufacturer Part Number: nRF51x22-QFAC; Datasheet: *; LatestRevisionDate: 2014-09-24; Pin Count: 48; Publisher: Nordic Semiconductor; Published: 2014-09-24; Value: nRF51x22-QFAC; Supplier: Nordic Semiconductor; Supplier part number: *; 2nd source Supplier: *; 2nd source part number: *; Footprint Doc: QFN-48; Artikkelnr Simpro: N.A.
X1 = XTAL_TSX-3225: XTAL SMD 16MHz, 9pF, Mercury; Part Number: XTAL SMD 16MHz (3225); Note: XTAL SMD 16MHz 3225; Artikkelnr Noca: 22019087; Value: 16MHz; Manufacturer: *; Manufacturer Part Number: *; Datasheet: http://ndap3-net.ebz.epson.co.jp/w/www/PDFS/epdoc_qd.nsf/85a4e2c523a1f89349257068002f9e30/31e98956c8f991cd4925707c003b38b1/$FILE/FA-238_238V_TSX-3225_E08X.pdf; Footprint: BT-XTAL_3225; LatestRevisionDate: 2010-02-24; Pin Count: 4; Publisher: Nordic Semiconductor; Published: 2009-05-30; Supplier: *; Supplier part number: *; 2nd source Supplier: *; 2nd source part number: *
X2 = XTAL_FC-135 32.768k: EPSON TOYOCOM - FC-135 32.768KHZ ±20PPM,9.0PF - CRYSTAL, SM, WATCH; Note: XTAL SMD 32.768kHz, 3215; Artikkelnr Noca: 2.20191e+007; Part Number: XTAL_FC-135 32.768k; Manufacturer: Epson Toyocom; Manufacturer Part Number: FC-135 32.768KHZ ±20PPM,9.0PF; Datasheet: http://www.farnell.com/datasheets/57480.pdf; Footprint: FC-135; LatestRevisionDate: 2010-10-18; Pin Count: 2; Publisher: Nordic Semiconductor; Published: 2010-10-18; Value: 32.768kHz; Supplier: Farnell; Supplier part number: 127-8037; 2nd source Supplier: *; 2nd source part number: *

## Sheet ALARM.SchDoc: Alarm and sound
size B; Author: Sebastien Gelinas; CompanyName: SmartHalo; Organization: SmartHalo; Address1: 5445 de Gaspé; Address2: Montréal, QC; Address3: Canada; Address4: H2T 3B2; Revision: 1; SheetNumber: 5; SheetTotal: 5
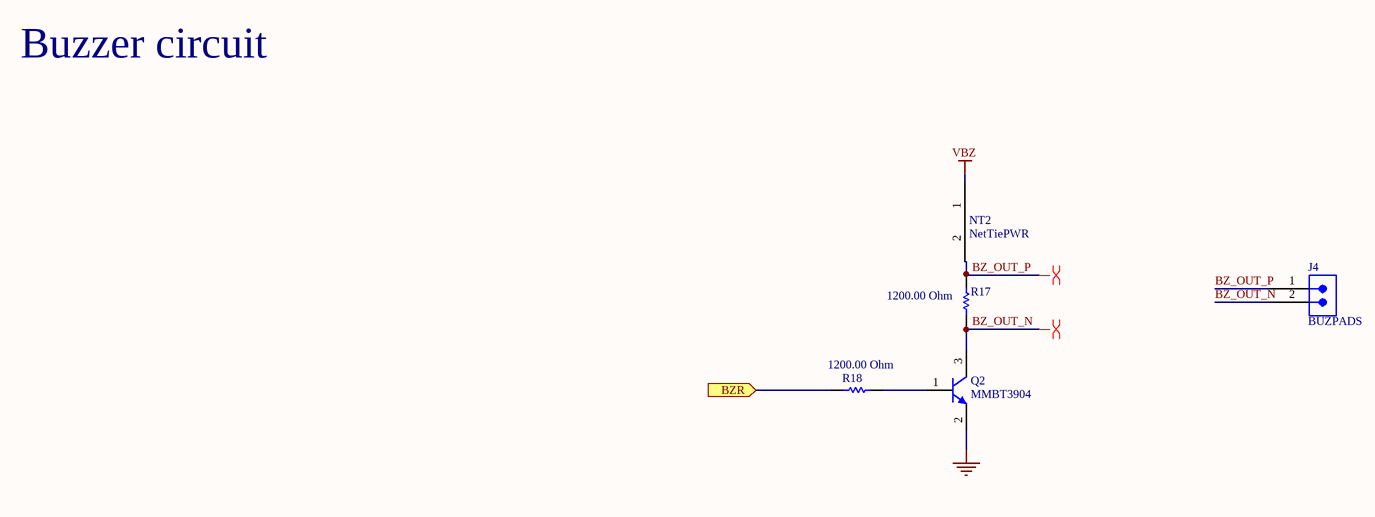
[diagram p3: ALARM.SchDoc]

### Parts
J4  BUZPADS  [BUZZERPADS]
NT2  NetTiePWR  [NetTiePWR]  (net tie, no BOM)
Q2  MMBT3904  [INF-SOT23_L]
R17  value 1200.00 Ohm  [RESC0402(1005)_N]  (hidden comment: 1K2 5% 0402(1005))
R18  value 1200.00 Ohm  [RESC0402(1005)_N]  (hidden comment: 1K2 5% 0402(1005))

### Ports
BZR

### Nets
GND: Q2.2(E)
VBZ: NT2.1(NET1)
BZ_OUT_N: J4.2 Q2.3(C) R17.1
BZ_OUT_P: J4.1 NT2.2(NET2) R17.2
P0.04: R18.1 ; port BZR
NetQ2_1: Q2.1(B) R18.2

### Layout directives
differential pair: BZ_OUT_N, BZ_OUT_P

### Notes on the sheet
- Buzzer circuit
- Title
- Size:
- Date:
- B
- Author:
- Time:
- Sheet
- Revision:
- of
- File:

### Library data of the parts
J4 = BUZPADS: Buzzer Pogo Pins, Sizes and Pitch TBD
Q2 = CMP-1178-00008-1: NPN Silicon Switching Transistor, 40 V VCEO, 200 mA IC, SOT23, Reel, Green; Manufacturer: Infineon; IC (max): 200 mA; VCBO (max): 60 V; VCE (max): 1 V; Green: TRUE; ICBO (max): 50 nA; IC: 10 mA; VCEO (max): 40 V; VEBO (max): 6 V; ComponentLink3Description: Package Specification; ComponentLink2Description: Datasheet; PackageDescription: 3-Pin Small Outline Transistor Package, 1.3 x 2.9 mm Body, 0.95 mm Pitch; Packing: Reel; ComponentLink1Description: Manufacturer URL; Polarity: NPN; ComponentLink3URL: http://www.infineon.com/dgdl/SOT23-Package_Overview.pdf?folderId=db3a30431936bc4b0119532290053c66&fileId=db3a30431936bc4b0119533468123c85; PackageReference: SOT23; Mounting Technology: Surface Mount; VCE: 1 V; ComponentLink2URL: http://www.infineon.com/dgdl/smbt3904series_mmbt3904.pdf?folderId=db3a30431441fb5d011445fab851018e&fileId=db3a30431441fb5d0114460005c10191; PartNumber: MMBT3904; PackageVersion: Apr-08; ComponentLink1URL: http://www.infineon.com/
R17 R18 = CMP-1011-00076-1: 1K2 0.063W 5% 0402 (1005 Metric)  SMD; Case-Metric: 1005; Case-EIA: 0402; Power: 0.063 W; Tolerance: 5 %; Technology: SMT

## Sheet CENTRALLEDS.SchDoc: Central LEDs
size B; Author: Sébastien Gélinas; Organization: SmartHalo; Address1: 5445 de Gaspé; Address2: Montréal, QC; Address3: Canada; Address4: H2T 3B2; Revision: 1; SheetNumber: 2; SheetTotal: 4
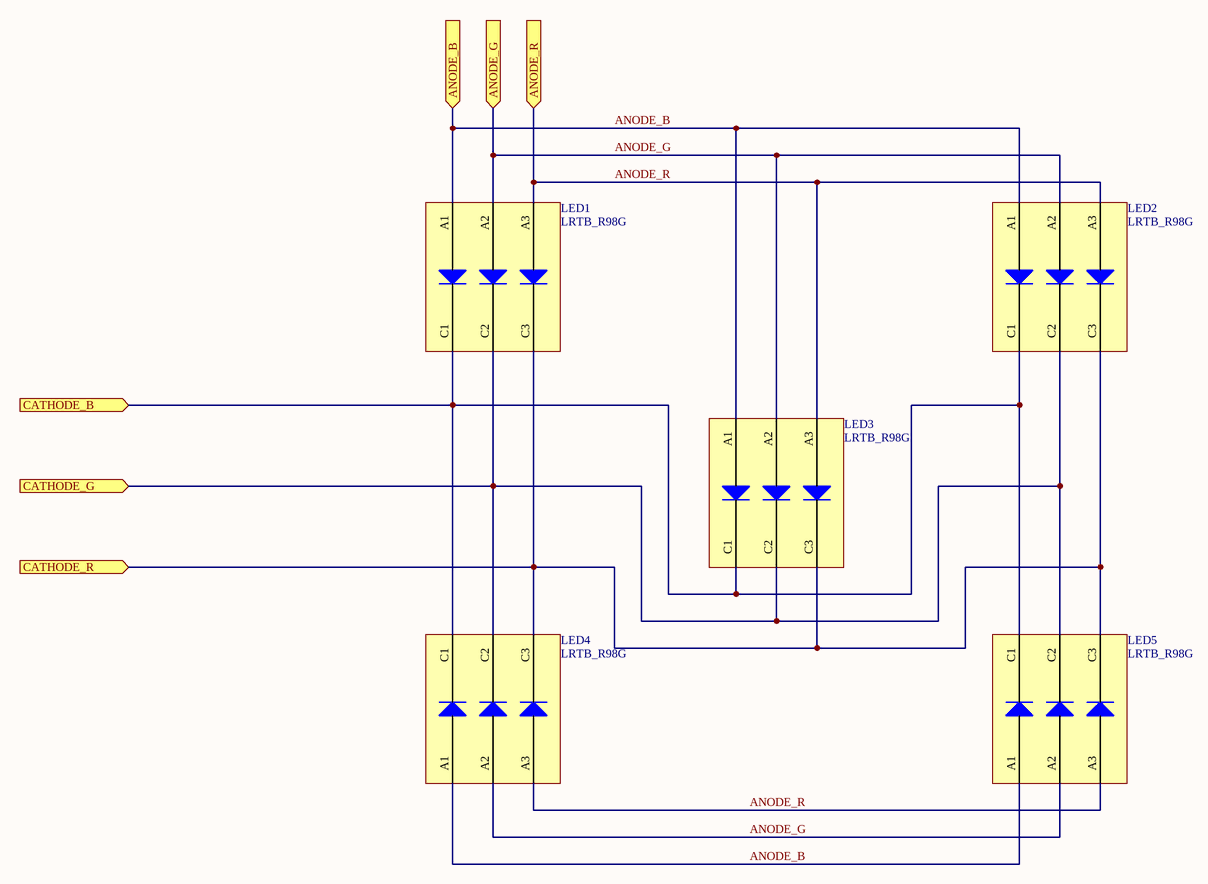
[diagram p4: CENTRALLEDS.SchDoc]

### Parts
LED1  LRTB_R98G  [LRTB_R98G]
LED2  LRTB_R98G  [LRTB_R98G]
LED3  LRTB_R98G  [LRTB_R98G]
LED4  LRTB_R98G  [LRTB_R98G]
LED5  LRTB_R98G  [LRTB_R98G]

### Ports
ANODE_B (in), ANODE_G (in), ANODE_R (in), CATHODE_B (in), CATHODE_G (in), CATHODE_R (in)

### Nets
ANODE_B: LED1.A1(Anode_Blue) LED2.A1(Anode_Blue) LED3.A1(Anode_Blue) LED4.A1(Anode_Blue) LED5.A1(Anode_Blue) ; port ANODE_B
ANODE_G: LED1.A2(Anode_Green) LED2.A2(Anode_Green) LED3.A2(Anode_Green) LED4.A2(Anode_Green) LED5.A2(Anode_Green) ; port ANODE_G
ANODE_R: LED1.A3(Anode_Red) LED2.A3(Anode_Red) LED3.A3(Anode_Red) LED4.A3(Anode_Red) LED5.A3(Anode_Red) ; port ANODE_R
NetLED1_C1: LED1.C1(Cathode_Blue) LED2.C1(Cathode_Blue) LED3.C1(Cathode_Blue) LED4.C1(Cathode_Blue) LED5.C1(Cathode_Blue) ; port CATHODE_B
NetLED1_C2: LED1.C2(Cathode_Green) LED2.C2(Cathode_Green) LED3.C2(Cathode_Green) LED4.C2(Cathode_Green) LED5.C2(Cathode_Green) ; port CATHODE_G
NetLED1_C3: LED1.C3(Cathode_Red) LED2.C3(Cathode_Red) LED3.C3(Cathode_Red) LED4.C3(Cathode_Red) LED5.C3(Cathode_Red) ; port CATHODE_R

### Notes on the sheet
- Title
- Size:
- Date:
- B
- Author:
- Time:
- Sheet
- Revision:
- of
- File:

### Library data of the parts
LED1-LED5 = LRTB_R98G: IC RGB LED OSRAM; Manufacturer: OSRAM

## Sheet DRIVERS_CONNECTORS.SchDoc: LED Drivers
size B; Author: Sébastien Gélinas; Organization: SmartHalo; Address1: 5445 de Gaspé; Address2: Montréal, QC; Address3: Canada; Address4: H2T 3B2; Revision: 1; SheetNumber: 1; SheetTotal: 4
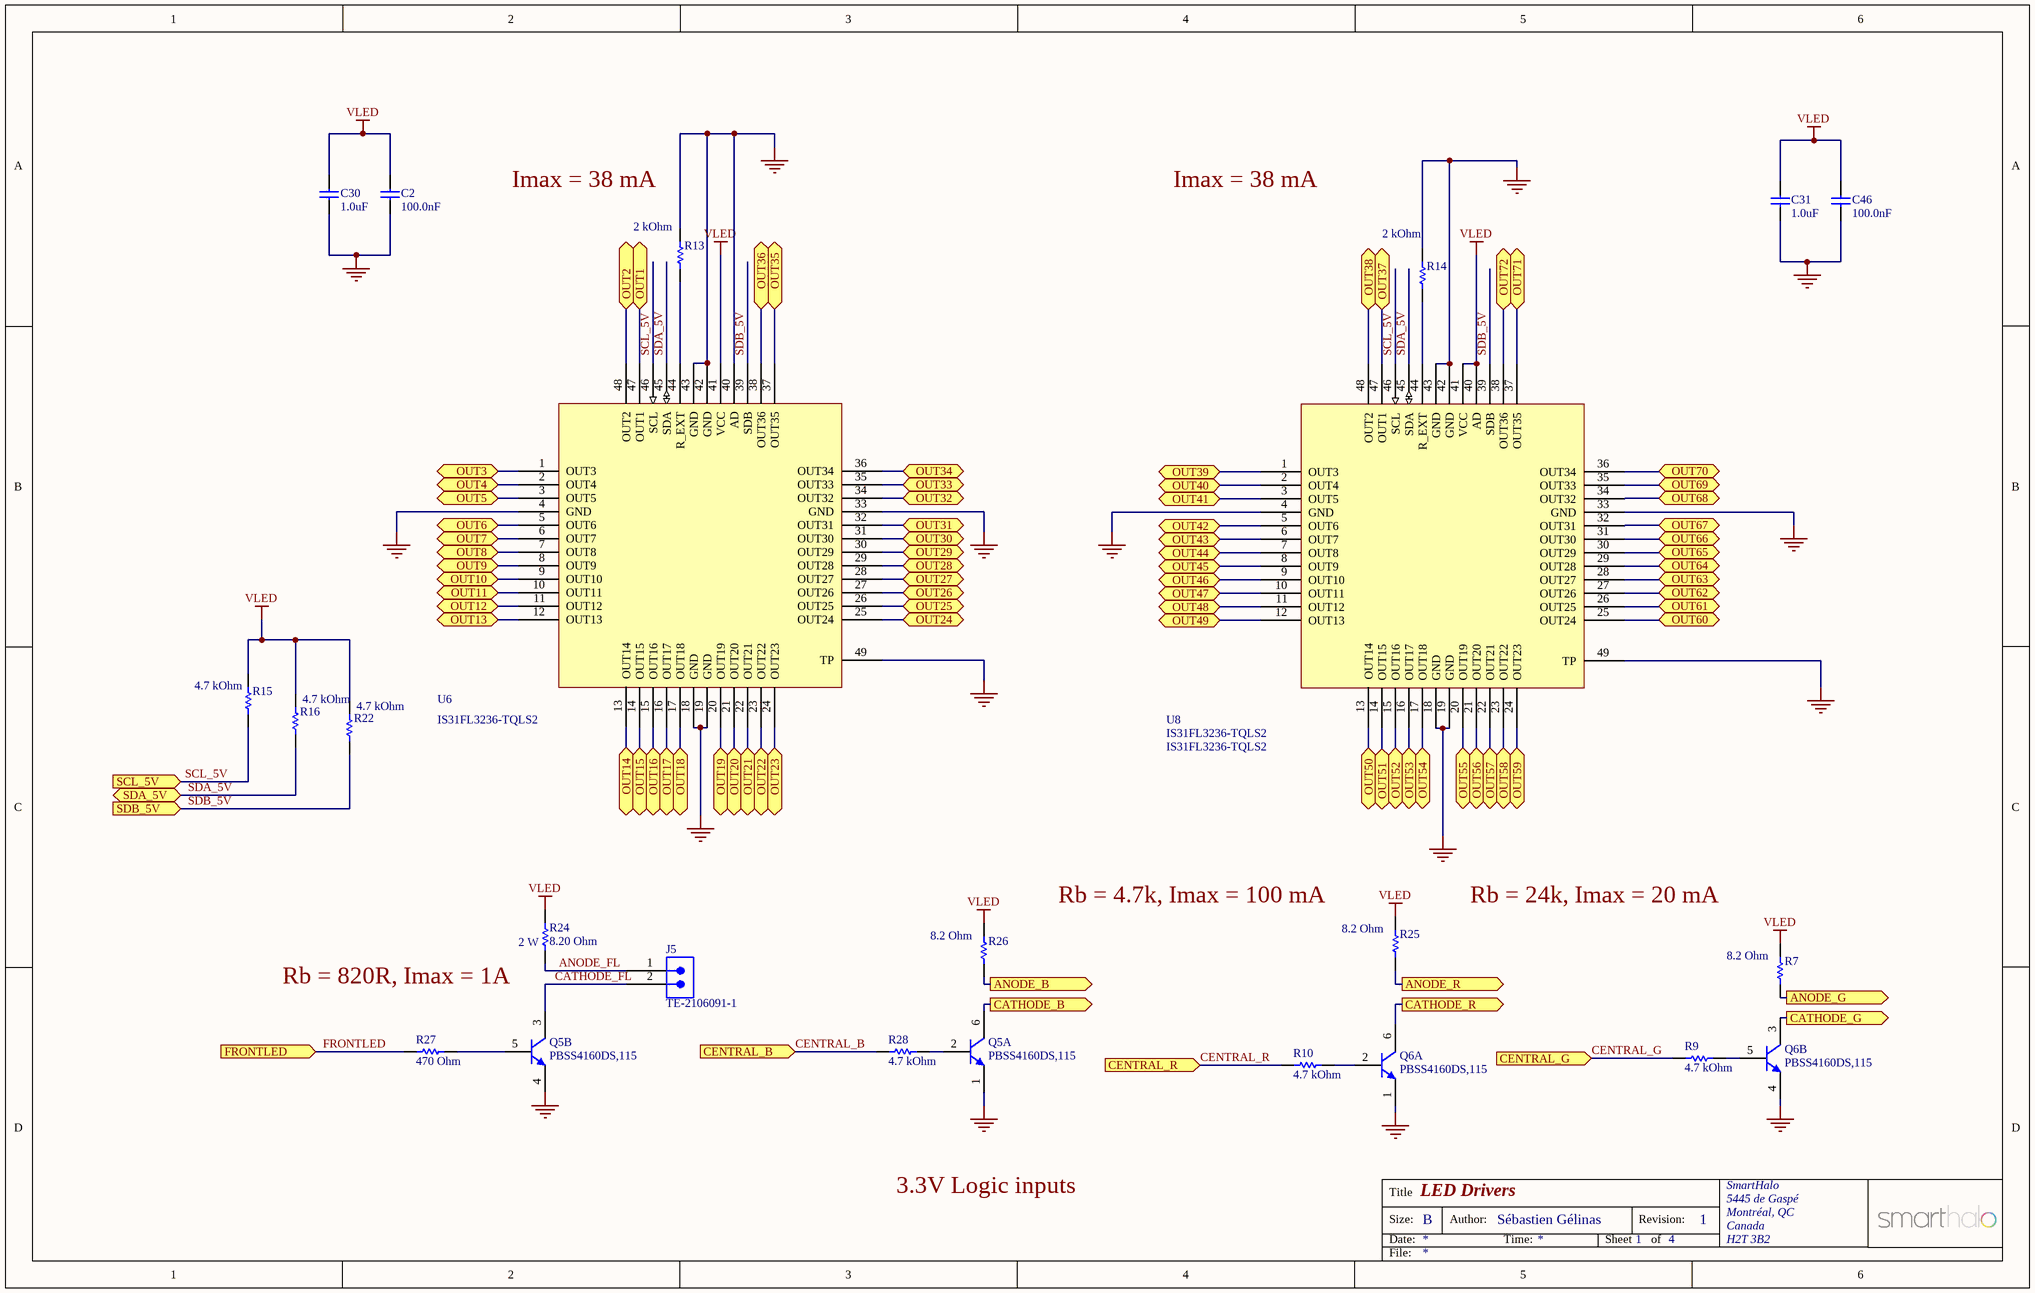
[diagram p5: DRIVERS_CONNECTORS.SchDoc]

### Parts
C2  100.0nF  [CAPC0603(1608)100_N]
C30  1.0uF  [CAPC0603(1608)100_N]
C31  1.0uF  [CAPC0603(1608)100_N]
C46  100.0nF  [CAPC0603(1608)100_N]
J5  TE-2106091-1  [TE-2106091-1]
Q5  PBSS4160DS,115  [NXP-SC74_M]  (parts A,B of 2)
Q6  PBSS4160DS,115  [NXP-SC74_M]  (parts A,B of 2)
R7  8.2 Ohm  [RESC0603(1608)_N]
R9  4.7 kOhm  [RESC0603(1608)_N]
R10  4.7 kOhm  [RESC0603(1608)_N]
R13  2 kOhm  [RESC0603(1608)_N]
R14  2 kOhm  [RESC0603(1608)_N]
R15  4.7 kOhm  [RESC0603(1608)_N]
R16  4.7 kOhm  [RESC0603(1608)_N]
R22  4.7 kOhm  [RESC0603(1608)_N]
R24  8.20 Ohm  Power: 2 W  [RESC2512(6432)_N]
R25  8.2 Ohm  [RESC0603(1608)_N]
R26  8.2 Ohm  [RESC0603(1608)_N]
R27  470 Ohm  [RESC0603(1608)_N]
R28  4.7 kOhm  [RESC0603(1608)_N]
U6  IS31FL3236-TQLS2  [TQFP48]
U8  IS31FL3236-TQLS2  [TQFP48]

### Ports
ANODE_B (out), ANODE_G (out), ANODE_R (out), CATHODE_B (out), CATHODE_G (out), CATHODE_R (out), CENTRAL_B (in), CENTRAL_G (in), CENTRAL_R (in), FRONTLED (in), OUT1, OUT2, OUT3, OUT4, OUT5, OUT6, OUT7, OUT8, OUT9, OUT10, OUT11, OUT12, OUT13, OUT14, OUT15, OUT16, OUT17, OUT18, OUT19, OUT20, OUT21, OUT22, OUT23, OUT24, OUT25, OUT26, OUT27, OUT28, OUT29, OUT30, OUT31, OUT32, OUT33, OUT34, OUT35, OUT36, OUT37, OUT38, OUT39, OUT40, OUT41, OUT42, OUT43, OUT44, OUT45, OUT46, OUT47, OUT48, OUT49, OUT50, OUT51, OUT52, OUT53, OUT54, OUT55, OUT56, OUT57, OUT58, OUT59, OUT60, OUT61, OUT62, OUT63, OUT64, OUT65, OUT66, OUT67, OUT68, OUT69, OUT70, OUT71, OUT72, SCL_5V (in), SDA_5V (bidir), SDB_5V (in)

### Nets
GND: C2.2 C30.2 C31.2 C46.2 Q5.1(E1) Q5.4(E2) Q6.1(E1) Q6.4(E2) R13.2 R14.2 U6.4(GND) U6.18(GND) U6.19(GND) U6.33(GND) U6.40(AD) U6.42(GND) U6.43(GND) U6.49(TP) U8.4(GND) U8.18(GND) U8.19(GND) U8.33(GND) U8.42(GND) U8.43(GND) U8.49(TP)
VLED: C2.1 C30.1 C31.1 C46.1 R7.2 R15.2 R16.2 R22.2 R24.2 R25.2 R26.2 U6.41(VCC) U8.40(AD) U8.41(VCC)
ANODE_B: R26.1 ; port ANODE_B
ANODE_FL: J5.1 R24.1
ANODE_G: R7.1 ; port ANODE_G
ANODE_R: R25.1 ; port ANODE_R
CATHODE_FL: J5.2 Q5.3(C2)
CENTRAL_B: R28.2 ; port CENTRAL_B
CENTRAL_G: R9.2 ; port CENTRAL_G
CENTRAL_R: R10.2 ; port CENTRAL_R
FRONTLED: R27.2 ; port FRONTLED
SCL_5V: R15.1 U6.46(SCL) U8.46(SCL) ; port SCL_5V
SDA_5V: R16.1 U6.45(SDA) U8.45(SDA) ; port SDA_5V
SDB_5V: R22.1 U6.39(SDB) U8.39(SDB) ; port SDB_5V
NetLED1_C1: Q5.6(C1) ; port CATHODE_B
NetLED1_C2: Q6.3(C2) ; port CATHODE_G
NetLED1_C3: Q6.6(C1) ; port CATHODE_R
NetLED6_C1: U6.20(OUT19) ; port OUT19
NetLED6_C2: U6.21(OUT20) ; port OUT20
NetLED6_C3: U6.22(OUT21) ; port OUT21
NetLED7_C1: U6.15(OUT16) ; port OUT16
NetLED7_C2: U6.16(OUT17) ; port OUT17
NetLED7_C3: U6.17(OUT18) ; port OUT18
NetLED8_C1: U6.12(OUT13) ; port OUT13
NetLED8_C2: U6.13(OUT14) ; port OUT14
NetLED8_C3: U6.14(OUT15) ; port OUT15
NetLED9_C1: U6.9(OUT10) ; port OUT10
NetLED9_C2: U6.10(OUT11) ; port OUT11
NetLED9_C3: U6.11(OUT12) ; port OUT12
NetLED10_C1: U6.6(OUT7) ; port OUT7
NetLED10_C2: U6.7(OUT8) ; port OUT8
NetLED10_C3: U6.8(OUT9) ; port OUT9
NetLED11_C1: U6.2(OUT4) ; port OUT4
NetLED11_C2: U6.3(OUT5) ; port OUT5
NetLED11_C3: U6.5(OUT6) ; port OUT6
NetLED12_C1: U6.47(OUT1) ; port OUT1
NetLED12_C2: U6.48(OUT2) ; port OUT2
NetLED12_C3: U6.1(OUT3) ; port OUT3
NetLED13_C1: U8.36(OUT34) ; port OUT70
NetLED13_C2: U8.37(OUT35) ; port OUT71
NetLED13_C3: U8.38(OUT36) ; port OUT72
NetLED14_C1: U8.32(OUT31) ; port OUT67
NetLED14_C2: U8.34(OUT32) ; port OUT68
NetLED14_C3: U8.35(OUT33) ; port OUT69
NetLED15_C1: U8.29(OUT28) ; port OUT64
NetLED15_C2: U8.30(OUT29) ; port OUT65
NetLED15_C3: U8.31(OUT30) ; port OUT66
NetLED16_C1: U8.26(OUT25) ; port OUT61
NetLED16_C2: U8.27(OUT26) ; port OUT62
NetLED16_C3: U8.28(OUT27) ; port OUT63
NetLED17_C1: U8.23(OUT22) ; port OUT58
NetLED17_C2: U8.24(OUT23) ; port OUT59
NetLED17_C3: U8.25(OUT24) ; port OUT60
NetLED18_C1: U8.20(OUT19) ; port OUT55
NetLED18_C2: U8.21(OUT20) ; port OUT56
NetLED18_C3: U8.22(OUT21) ; port OUT57
NetLED19_C1: U8.15(OUT16) ; port OUT52
NetLED19_C2: U8.16(OUT17) ; port OUT53
NetLED19_C3: U8.17(OUT18) ; port OUT54
NetLED20_C1: U8.12(OUT13) ; port OUT49
NetLED20_C2: U8.13(OUT14) ; port OUT50
NetLED20_C3: U8.14(OUT15) ; port OUT51
NetLED21_C1: U8.9(OUT10) ; port OUT46
NetLED21_C2: U8.10(OUT11) ; port OUT47
NetLED21_C3: U8.11(OUT12) ; port OUT48
NetLED22_C1: U8.6(OUT7) ; port OUT43
NetLED22_C2: U8.7(OUT8) ; port OUT44
NetLED22_C3: U8.8(OUT9) ; port OUT45
NetLED23_C1: U8.2(OUT4) ; port OUT40
NetLED23_C2: U8.3(OUT5) ; port OUT41
NetLED23_C3: U8.5(OUT6) ; port OUT42
NetLED24_C1: U8.47(OUT1) ; port OUT37
NetLED24_C2: U8.48(OUT2) ; port OUT38
NetLED24_C3: U8.1(OUT3) ; port OUT39
NetLED25_C1: U6.36(OUT34) ; port OUT34
NetLED25_C2: U6.37(OUT35) ; port OUT35
NetLED25_C3: U6.38(OUT36) ; port OUT36
NetLED26_C1: U6.32(OUT31) ; port OUT31
NetLED26_C2: U6.34(OUT32) ; port OUT32
NetLED26_C3: U6.35(OUT33) ; port OUT33
NetLED27_C1: U6.29(OUT28) ; port OUT28
NetLED27_C2: U6.30(OUT29) ; port OUT29
NetLED27_C3: U6.31(OUT30) ; port OUT30
NetLED28_C1: U6.26(OUT25) ; port OUT25
NetLED28_C2: U6.27(OUT26) ; port OUT26
NetLED28_C3: U6.28(OUT27) ; port OUT27
NetLED29_C1: U6.23(OUT22) ; port OUT22
NetLED29_C2: U6.24(OUT23) ; port OUT23
NetLED29_C3: U6.25(OUT24) ; port OUT24
NetQ5_2: Q5.2(B1) R28.1
NetQ5_5: Q5.5(B2) R27.1
NetQ6_2: Q6.2(B1) R10.1
NetQ6_5: Q6.5(B2) R9.1
NetR13_1: R13.1 U6.44(R_EXT)
NetR14_1: R14.1 U8.44(R_EXT)

### Notes on the sheet
- (near R13) Imax = 38 mA
- Imax = 38 mA
- Rb = 4.7k, Imax = 100 mA
- Rb = 24k, Imax = 20 mA
- (near R24) Rb = 820R, Imax = 1A
- 3.3V Logic inputs
- Title
- Size:
- Date:
- B
- Author:
- Time:
- Sheet
- Revision:
- of
- File:

### Library data of the parts
C2 C30 C31 C46 = CAP0603: Chip Cap 0603 X7R 10%; Part Number: C0402-1n0; Note: Chip Cap X7R 10%; Artikkelnr Noca: 20039223; Published: 2009-05-08; LatestRevisionDate: 2009-11-23; Publisher: Nordic Semiconductor; Manufacturer: *; Manufacturer Part Number: *; Datasheet: *; Footprint: 0603; Pin Count: 2; Supplier: *
  C2 C46: Value: 100.0nF
  C30 C31: Value: 1.0uF
J5 = TE-2106091-1: as J1 on sheet PWR; Manufacturer Part Number: 2106091
Q5 Q6 = PBSS4160DS,115: TRANS 2NPN 60V 1A 6TSOP; Manufacturer: NXP Semiconductors; Polarity: NPN; Mounting Technology: Surface Mount; PackageDescription: 6-Pin Semiconductor Package, 2.9 x 1.6 mm Body, 0.95 mm Pitch; PackageReference: SC74; PartNumber: PBSS4160DS; Manufacturer Part Number: PBSS4160DS,115; Digi-Key Part Number: 568-4350-1-ND
R7 R25 R26 = CMP-1012-00090-1: 8R2 0.1W 5% 0603 (1608 Metric)  SMD; Case-Metric: 1608; Case-EIA: 0603; Tolerance: 5 %; Technology: SMT; Power: 0.1 W; Value: 8.2 Ohm
R9 R10 R15 R16 R22 R28 = CMP-1012-00090-1: 4K7 0.1W 5% 0603 (1608 Metric)  SMD; Case-Metric: 1608; Case-EIA: 0603; Tolerance: 5 %; Technology: SMT; Power: 0.1 W; Value: 4.7 kOhm
R13 R14 = CMP-1012-00090-1: 2k 0.1W 5% 0603 (1608 Metric)  SMD; Case-Metric: 1608; Case-EIA: 0603; Tolerance: 5 %; Technology: SMT; Power: 0.1 W; Value: 2 kOhm
R24 = CMP-1018-00024-1: 8R2 2W 5% 2512 (6432 Metric)  SMD; Case-Metric: 6432; Case-EIA: 2512; Value: 8.20 Ohm; Tolerance: 5 %; Technology: SMT
R27 = CMP-1012-00090-1: 470R 1/16W 5% 0603 (1608 Metric)  SMD; Case-Metric: 1608; Case-EIA: 0603; Tolerance: 5 %; Technology: SMT; Power: 1/16 W; Value: 470 Ohm
U6 U8 = IS31FL3236-TQLS2: IC 36 CHANNELS LED DRIVER; Manufacturer: ISSI; Manufacturer Part Number: IS31FL3236-TQLS2

## Sheet LEDS1.SchDoc: LEDS 1
size B; Author: Sébastien Gélinas; Organization: SmartHalo; Address1: 5445 de Gaspé; Address2: Montréal, QC; Address3: Canada; Address4: H2T 3B2; Revision: 1; SheetNumber: 3; SheetTotal: 4
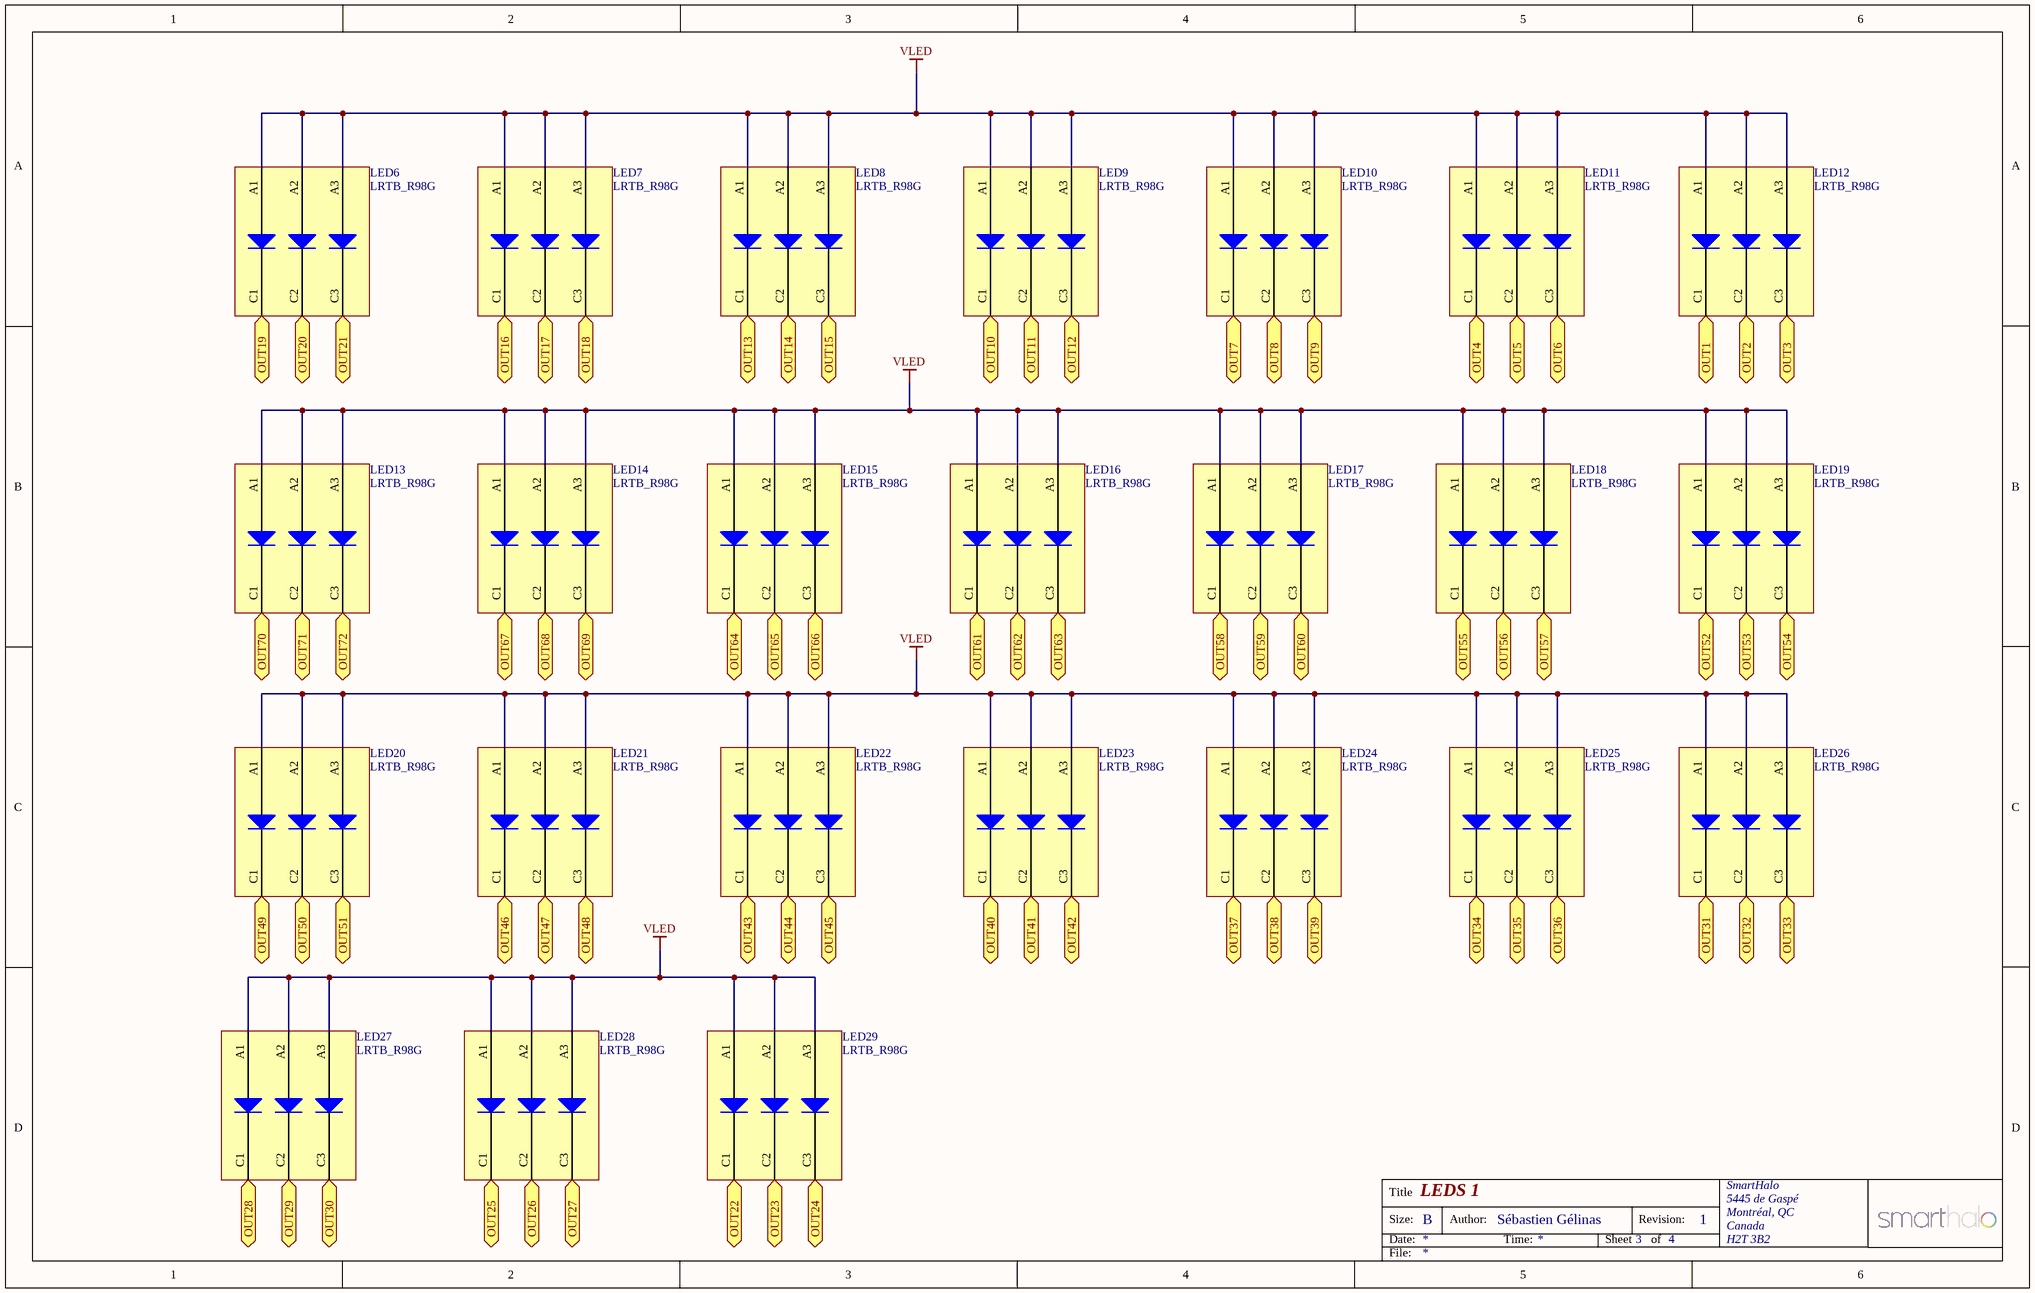
[diagram p6: LEDS1.SchDoc]

### Parts
LED6  LRTB_R98G  [LRTB_R98G]
LED7  LRTB_R98G  [LRTB_R98G]
LED8  LRTB_R98G  [LRTB_R98G]
LED9  LRTB_R98G  [LRTB_R98G]
LED10  LRTB_R98G  [LRTB_R98G]
LED11  LRTB_R98G  [LRTB_R98G]
LED12  LRTB_R98G  [LRTB_R98G]
LED13  LRTB_R98G  [LRTB_R98G]
LED14  LRTB_R98G  [LRTB_R98G]
LED15  LRTB_R98G  [LRTB_R98G]
LED16  LRTB_R98G  [LRTB_R98G]
LED17  LRTB_R98G  [LRTB_R98G]
LED18  LRTB_R98G  [LRTB_R98G]
LED19  LRTB_R98G  [LRTB_R98G]
LED20  LRTB_R98G  [LRTB_R98G]
LED21  LRTB_R98G  [LRTB_R98G]
LED22  LRTB_R98G  [LRTB_R98G]
LED23  LRTB_R98G  [LRTB_R98G]
LED24  LRTB_R98G  [LRTB_R98G]
LED25  LRTB_R98G  [LRTB_R98G]
LED26  LRTB_R98G  [LRTB_R98G]
LED27  LRTB_R98G  [LRTB_R98G]
LED28  LRTB_R98G  [LRTB_R98G]
LED29  LRTB_R98G  [LRTB_R98G]

### Ports
OUT1, OUT2, OUT3, OUT4, OUT5, OUT6, OUT7, OUT8, OUT9, OUT10, OUT11, OUT12, OUT13, OUT14, OUT15, OUT16, OUT17, OUT18, OUT19, OUT20, OUT21, OUT22, OUT23, OUT24, OUT25, OUT26, OUT27, OUT28, OUT29, OUT30, OUT31, OUT32, OUT33, OUT34, OUT35, OUT36, OUT37, OUT38, OUT39, OUT40, OUT41, OUT42, OUT43, OUT44, OUT45, OUT46, OUT47, OUT48, OUT49, OUT50, OUT51, OUT52, OUT53, OUT54, OUT55, OUT56, OUT57, OUT58, OUT59, OUT60, OUT61, OUT62, OUT63, OUT64, OUT65, OUT66, OUT67, OUT68, OUT69, OUT70, OUT71, OUT72

### Nets
VLED: LED6.A1(Anode_Blue) LED6.A2(Anode_Green) LED6.A3(Anode_Red) LED7.A1(Anode_Blue) LED7.A2(Anode_Green) LED7.A3(Anode_Red) LED8.A1(Anode_Blue) LED8.A2(Anode_Green) LED8.A3(Anode_Red) LED9.A1(Anode_Blue) LED9.A2(Anode_Green) LED9.A3(Anode_Red) LED10.A1(Anode_Blue) LED10.A2(Anode_Green) LED10.A3(Anode_Red) LED11.A1(Anode_Blue) LED11.A2(Anode_Green) LED11.A3(Anode_Red) LED12.A1(Anode_Blue) LED12.A2(Anode_Green) LED12.A3(Anode_Red) LED13.A1(Anode_Blue) LED13.A2(Anode_Green) LED13.A3(Anode_Red) LED14.A1(Anode_Blue) LED14.A2(Anode_Green) LED14.A3(Anode_Red) LED15.A1(Anode_Blue) LED15.A2(Anode_Green) LED15.A3(Anode_Red) LED16.A1(Anode_Blue) LED16.A2(Anode_Green) LED16.A3(Anode_Red) LED17.A1(Anode_Blue) LED17.A2(Anode_Green) LED17.A3(Anode_Red) LED18.A1(Anode_Blue) LED18.A2(Anode_Green) LED18.A3(Anode_Red) LED19.A1(Anode_Blue) LED19.A2(Anode_Green) LED19.A3(Anode_Red) LED20.A1(Anode_Blue) LED20.A2(Anode_Green) LED20.A3(Anode_Red) LED21.A1(Anode_Blue) LED21.A2(Anode_Green) LED21.A3(Anode_Red) LED22.A1(Anode_Blue) LED22.A2(Anode_Green) LED22.A3(Anode_Red) LED23.A1(Anode_Blue) LED23.A2(Anode_Green) LED23.A3(Anode_Red) LED24.A1(Anode_Blue) LED24.A2(Anode_Green) LED24.A3(Anode_Red) LED25.A1(Anode_Blue) LED25.A2(Anode_Green) LED25.A3(Anode_Red) LED26.A1(Anode_Blue) LED26.A2(Anode_Green) LED26.A3(Anode_Red) LED27.A1(Anode_Blue) LED27.A2(Anode_Green) LED27.A3(Anode_Red) LED28.A1(Anode_Blue) LED28.A2(Anode_Green) LED28.A3(Anode_Red) LED29.A1(Anode_Blue) LED29.A2(Anode_Green) LED29.A3(Anode_Red)
NetLED6_C1: LED6.C1(Cathode_Blue) ; port OUT19
NetLED6_C2: LED6.C2(Cathode_Green) ; port OUT20
NetLED6_C3: LED6.C3(Cathode_Red) ; port OUT21
NetLED7_C1: LED7.C1(Cathode_Blue) ; port OUT16
NetLED7_C2: LED7.C2(Cathode_Green) ; port OUT17
NetLED7_C3: LED7.C3(Cathode_Red) ; port OUT18
NetLED8_C1: LED8.C1(Cathode_Blue) ; port OUT13
NetLED8_C2: LED8.C2(Cathode_Green) ; port OUT14
NetLED8_C3: LED8.C3(Cathode_Red) ; port OUT15
NetLED9_C1: LED9.C1(Cathode_Blue) ; port OUT10
NetLED9_C2: LED9.C2(Cathode_Green) ; port OUT11
NetLED9_C3: LED9.C3(Cathode_Red) ; port OUT12
NetLED10_C1: LED10.C1(Cathode_Blue) ; port OUT7
NetLED10_C2: LED10.C2(Cathode_Green) ; port OUT8
NetLED10_C3: LED10.C3(Cathode_Red) ; port OUT9
NetLED11_C1: LED11.C1(Cathode_Blue) ; port OUT4
NetLED11_C2: LED11.C2(Cathode_Green) ; port OUT5
NetLED11_C3: LED11.C3(Cathode_Red) ; port OUT6
NetLED12_C1: LED12.C1(Cathode_Blue) ; port OUT1
NetLED12_C2: LED12.C2(Cathode_Green) ; port OUT2
NetLED12_C3: LED12.C3(Cathode_Red) ; port OUT3
NetLED13_C1: LED13.C1(Cathode_Blue) ; port OUT70
NetLED13_C2: LED13.C2(Cathode_Green) ; port OUT71
NetLED13_C3: LED13.C3(Cathode_Red) ; port OUT72
NetLED14_C1: LED14.C1(Cathode_Blue) ; port OUT67
NetLED14_C2: LED14.C2(Cathode_Green) ; port OUT68
NetLED14_C3: LED14.C3(Cathode_Red) ; port OUT69
NetLED15_C1: LED15.C1(Cathode_Blue) ; port OUT64
NetLED15_C2: LED15.C2(Cathode_Green) ; port OUT65
NetLED15_C3: LED15.C3(Cathode_Red) ; port OUT66
NetLED16_C1: LED16.C1(Cathode_Blue) ; port OUT61
NetLED16_C2: LED16.C2(Cathode_Green) ; port OUT62
NetLED16_C3: LED16.C3(Cathode_Red) ; port OUT63
NetLED17_C1: LED17.C1(Cathode_Blue) ; port OUT58
NetLED17_C2: LED17.C2(Cathode_Green) ; port OUT59
NetLED17_C3: LED17.C3(Cathode_Red) ; port OUT60
NetLED18_C1: LED18.C1(Cathode_Blue) ; port OUT55
NetLED18_C2: LED18.C2(Cathode_Green) ; port OUT56
NetLED18_C3: LED18.C3(Cathode_Red) ; port OUT57
NetLED19_C1: LED19.C1(Cathode_Blue) ; port OUT52
NetLED19_C2: LED19.C2(Cathode_Green) ; port OUT53
NetLED19_C3: LED19.C3(Cathode_Red) ; port OUT54
NetLED20_C1: LED20.C1(Cathode_Blue) ; port OUT49
NetLED20_C2: LED20.C2(Cathode_Green) ; port OUT50
NetLED20_C3: LED20.C3(Cathode_Red) ; port OUT51
NetLED21_C1: LED21.C1(Cathode_Blue) ; port OUT46
NetLED21_C2: LED21.C2(Cathode_Green) ; port OUT47
NetLED21_C3: LED21.C3(Cathode_Red) ; port OUT48
NetLED22_C1: LED22.C1(Cathode_Blue) ; port OUT43
NetLED22_C2: LED22.C2(Cathode_Green) ; port OUT44
NetLED22_C3: LED22.C3(Cathode_Red) ; port OUT45
NetLED23_C1: LED23.C1(Cathode_Blue) ; port OUT40
NetLED23_C2: LED23.C2(Cathode_Green) ; port OUT41
NetLED23_C3: LED23.C3(Cathode_Red) ; port OUT42
NetLED24_C1: LED24.C1(Cathode_Blue) ; port OUT37
NetLED24_C2: LED24.C2(Cathode_Green) ; port OUT38
NetLED24_C3: LED24.C3(Cathode_Red) ; port OUT39
NetLED25_C1: LED25.C1(Cathode_Blue) ; port OUT34
NetLED25_C2: LED25.C2(Cathode_Green) ; port OUT35
NetLED25_C3: LED25.C3(Cathode_Red) ; port OUT36
NetLED26_C1: LED26.C1(Cathode_Blue) ; port OUT31
NetLED26_C2: LED26.C2(Cathode_Green) ; port OUT32
NetLED26_C3: LED26.C3(Cathode_Red) ; port OUT33
NetLED27_C1: LED27.C1(Cathode_Blue) ; port OUT28
NetLED27_C2: LED27.C2(Cathode_Green) ; port OUT29
NetLED27_C3: LED27.C3(Cathode_Red) ; port OUT30
NetLED28_C1: LED28.C1(Cathode_Blue) ; port OUT25
NetLED28_C2: LED28.C2(Cathode_Green) ; port OUT26
NetLED28_C3: LED28.C3(Cathode_Red) ; port OUT27
NetLED29_C1: LED29.C1(Cathode_Blue) ; port OUT22
NetLED29_C2: LED29.C2(Cathode_Green) ; port OUT23
NetLED29_C3: LED29.C3(Cathode_Red) ; port OUT24

### Notes on the sheet
- Title
- Size:
- Date:
- B
- Author:
- Time:
- Sheet
- Revision:
- of
- File:

### Library data of the parts
LED6-LED29 = LRTB_R98G: IC RGB LED OSRAM; Manufacturer: OSRAM